# Altium project QUTMS-BMS-V01.PrjPcb
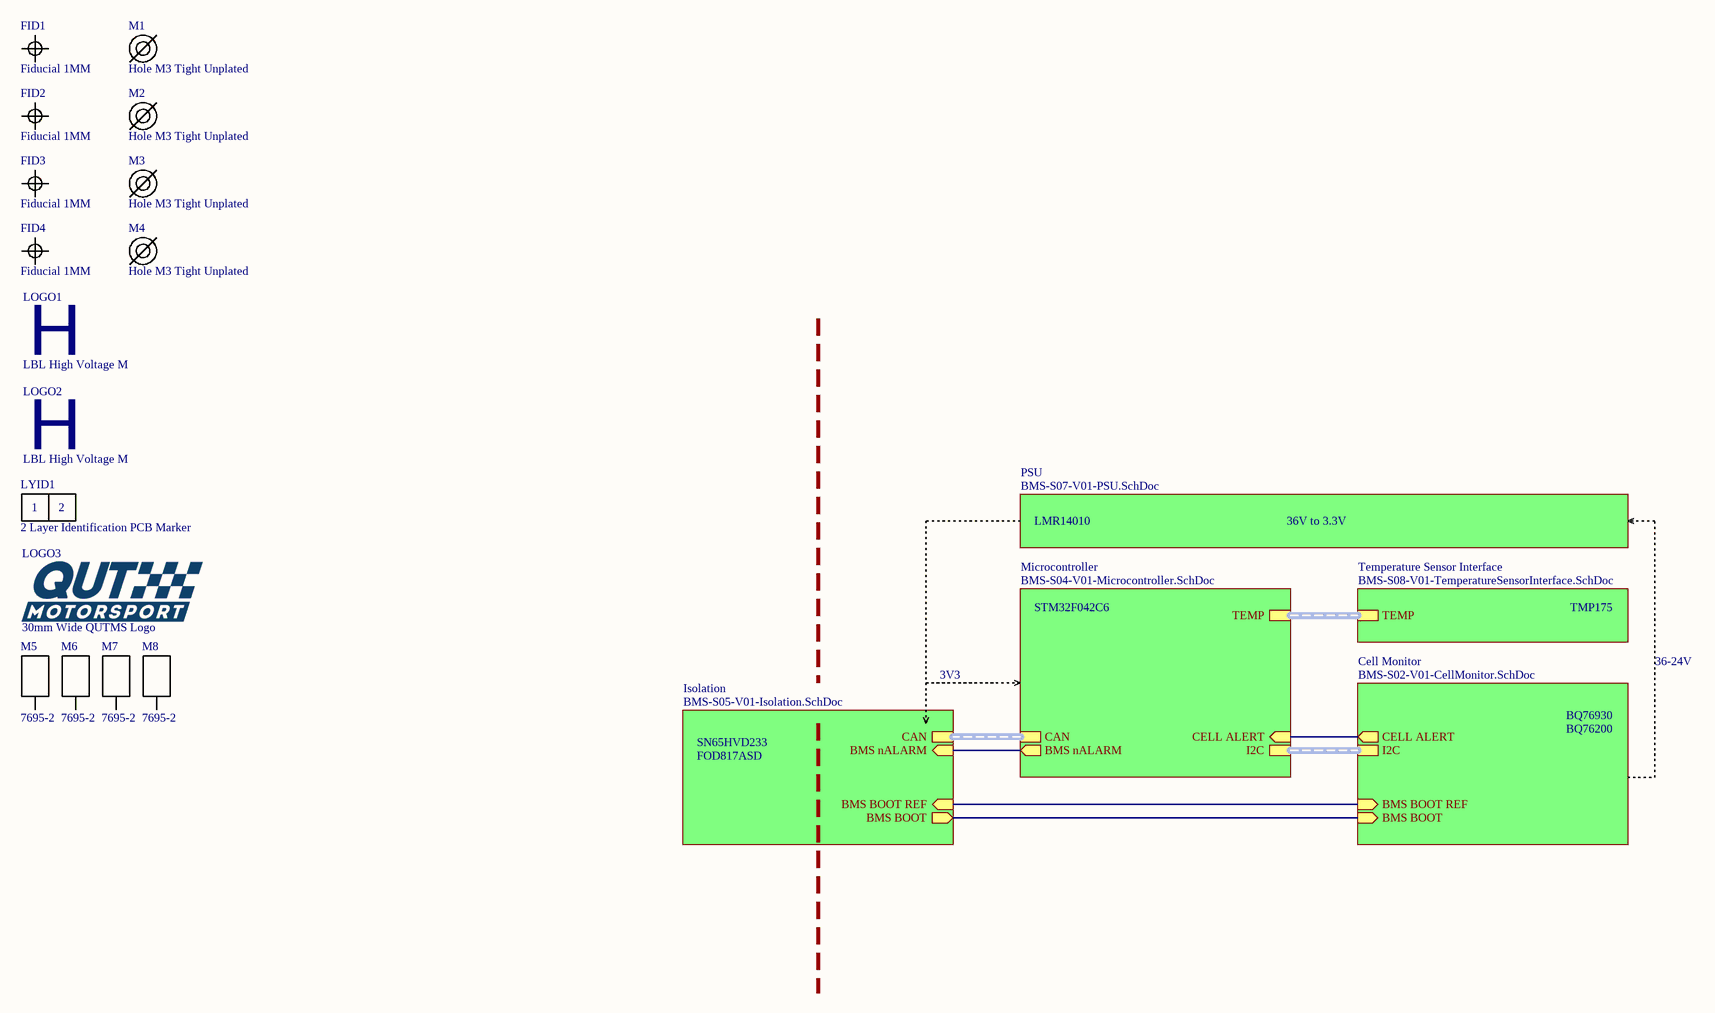
[diagram p0: BMS-S01-V01-BatteryManagementSystem.SchDoc]
9 sheets, 232 parts. Net scope: hierarchical (ports join the sheet entries above them; power ports are global).
Board file: BMS-P00-V01.PcbDoc
Sheets:
  BMS-S01-V01-BatteryManagementSystem.SchDoc
    Isolation = BMS-S05-V01-Isolation.SchDoc
      Isolated CAN = BMS-S06-V01-IsolatedCAN.SchDoc
    Microcontroller = BMS-S04-V01-Microcontroller.SchDoc
    Cell Monitor = BMS-S02-V01-CellMonitor.SchDoc
      CELL 10 INTERFACE = BMS-S03-V01-CellInterface.SchDoc
      CELL 1 INTERFACE = BMS-S03-V01-CellInterface.SchDoc
      CELL 2 INTERFACE = BMS-S03-V01-CellInterface.SchDoc
      CELL 3 INTERFACE = BMS-S03-V01-CellInterface.SchDoc
      CELL 4 INTERFACE = BMS-S03-V01-CellInterface.SchDoc
      CELL 5 INTERFACE = BMS-S03-V01-CellInterface.SchDoc
      CELL 6 INTERFACE = BMS-S03-V01-CellInterface.SchDoc
      CELL 7 INTERFACE = BMS-S03-V01-CellInterface.SchDoc
      CELL 8 INTERFACE = BMS-S03-V01-CellInterface.SchDoc
      CELL 9 INTERFACE = BMS-S03-V01-CellInterface.SchDoc
    PSU = BMS-S07-V01-PSU.SchDoc
    Temperature Sensor Interface = BMS-S08-V01-TemperatureSensorInterface.SchDoc
      FlexPCBTempSensors1 = BMS-S09-V01-TemperatureSensors.SchDoc
      FlexPCBTempSensors2 = BMS-S09-V01-TemperatureSensors.SchDoc
      FlexPCBTempSensors3 = BMS-S09-V01-TemperatureSensors.SchDoc
      FlexPCBTempSensors4 = BMS-S09-V01-TemperatureSensors.SchDoc

## Sheet BMS-S01-V01-BatteryManagementSystem.SchDoc: BMS Master
size A3; DrawnBy: Jonn Dillon; DocumentNumber: 1; Revision: 01; SheetNumber: 1; SheetTotal: 10; Version: 01; Project: Battery Managment System 2020; PageSetup: Record=PageOptions|CenterHorizontal=True|CenterVertical=True|PrintScale=0.97|XCorrection=1.00|YCorrection=1.00|PrintKind=0|BorderSize=5000000|LeftOffset=0|BottomOffset=0|Orientation=2|PaperLength=1000|PaperWidth=1000|Scale=100|PaperSource=7|PrintQuality=-4|MediaType=1|DitherType=10|PaperKind=A4|PrintScaleMode=1

### Parts
FID1  Fiducial 1MM  [FIDUCIAL 1MM]
FID2  Fiducial 1MM  [FIDUCIAL 1MM]
FID3  Fiducial 1MM  [FIDUCIAL 1MM]
FID4  Fiducial 1MM  [FIDUCIAL 1MM]
LOGO1  LBL High Voltage M  [LBL HV MEDIUM]
LOGO2  LBL High Voltage M  [LBL HV MEDIUM]
LOGO3  30mm Wide QUTMS Logo  [QUTMS LOGO 30MM]
LYID1  2 Layer Identification PCB Marker  [LAYER IDENT 2]
M1  Hole M3 Tight Unplated  [M3.2 UNPLATED]
M2  Hole M3 Tight Unplated  [M3.2 UNPLATED]
M3  Hole M3 Tight Unplated  [M3.2 UNPLATED]
M4  Hole M3 Tight Unplated  [M3.2 UNPLATED]
M5  7695-2  [Keystone 7790]
M6  7695-2  [Keystone 7790]
M7  7695-2  [Keystone 7790]
M8  7695-2  [Keystone 7790]

### Sub-sheets
Cell Monitor = BMS-S02-V01-CellMonitor.SchDoc: BMS BOOT REF (in), BMS BOOT (in), I2C (harness I2C), CELL ALERT (out)
Isolation = BMS-S05-V01-Isolation.SchDoc: BMS BOOT (out), BMS nALARM (in), BMS BOOT REF (in), CAN (harness CAN)
Microcontroller = BMS-S04-V01-Microcontroller.SchDoc: I2C (harness I2C), CAN (harness CAN), BMS nALARM (out), CELL ALERT (in), TEMP (harness TEMP)
PSU = BMS-S07-V01-PSU.SchDoc: no entries
Temperature Sensor Interface = BMS-S08-V01-TemperatureSensorInterface.SchDoc: TEMP (harness TEMP)

### Nets
BMS BOOT: sheet Isolation/BMS BOOT, sheet Cell Monitor/BMS BOOT
BMS BOOT REF: sheet Isolation/BMS BOOT REF, sheet Cell Monitor/BMS BOOT REF
CELL ALERT: sheet Microcontroller/CELL ALERT, sheet Cell Monitor/CELL ALERT
nALARM: sheet Isolation/BMS nALARM, sheet Microcontroller/BMS nALARM

Not connected (* = marked no-connect by the designer): M5 0; M6 0; M7 0; M8 0

### Buses and harness runs
harness sheet Cell Monitor/I2C = sheet Microcontroller/I2C
harness sheet Isolation/CAN = sheet Microcontroller/CAN
harness sheet Microcontroller/TEMP = sheet Temperature Sensor Interface/TEMP

### Notes on the sheet
- LMR14010
- 36V to 3.3V
- STM32F042C6
- TMP175
- 3V3
- 36-24V
- SN65HVD233
- BQ76930
- BQ76200
- FOD817ASD
- Revision History:
- Sheet Title:
- Rev
- Date
- Description
- Project:
- Size:
- Drawn By:
- A3
- Number:
- Revision:
- Sheet
- Version:
- of
- QUT Motorsport
- O-120, Gardens Point
- 2 George Street
- Brisbane, QLD 4000
- Australia
- Print Date:
- Print Time:
- File Name:
- (in symbol Layer Identification 2) 1; 2
- (in symbol LBL High Voltage M) H

### Library data of the parts
LOGO3 = QUTMS Logo 30mm
LYID1 = Layer Identification 2
M1-M4 = Hole M3 Tight Unplated: M3.2 Hole, No Plating
M5-M8 = 7695-2: SNAP-INPC MOUNT

## Sheet BMS-S05-V01-Isolation.SchDoc: Isolation Barrier
size A3; DrawnBy: Jonn Dillon; DocumentNumber: 3; Revision: 01; SheetNumber: 3; SheetTotal: 10; Version: 01; Project: Battery Management System 2020; PageSetup: Record=PageOptions|CenterHorizontal=True|CenterVertical=True|PrintScale=0.97|XCorrection=1.00|YCorrection=1.00|PrintKind=0|BorderSize=5000000|LeftOffset=0|BottomOffset=0|Orientation=2|PaperLength=1000|PaperWidth=1000|Scale=100|PaperSource=7|PrintQuality=-4|MediaType=1|DitherType=10|PaperKind=A4|PrintScaleMode=1
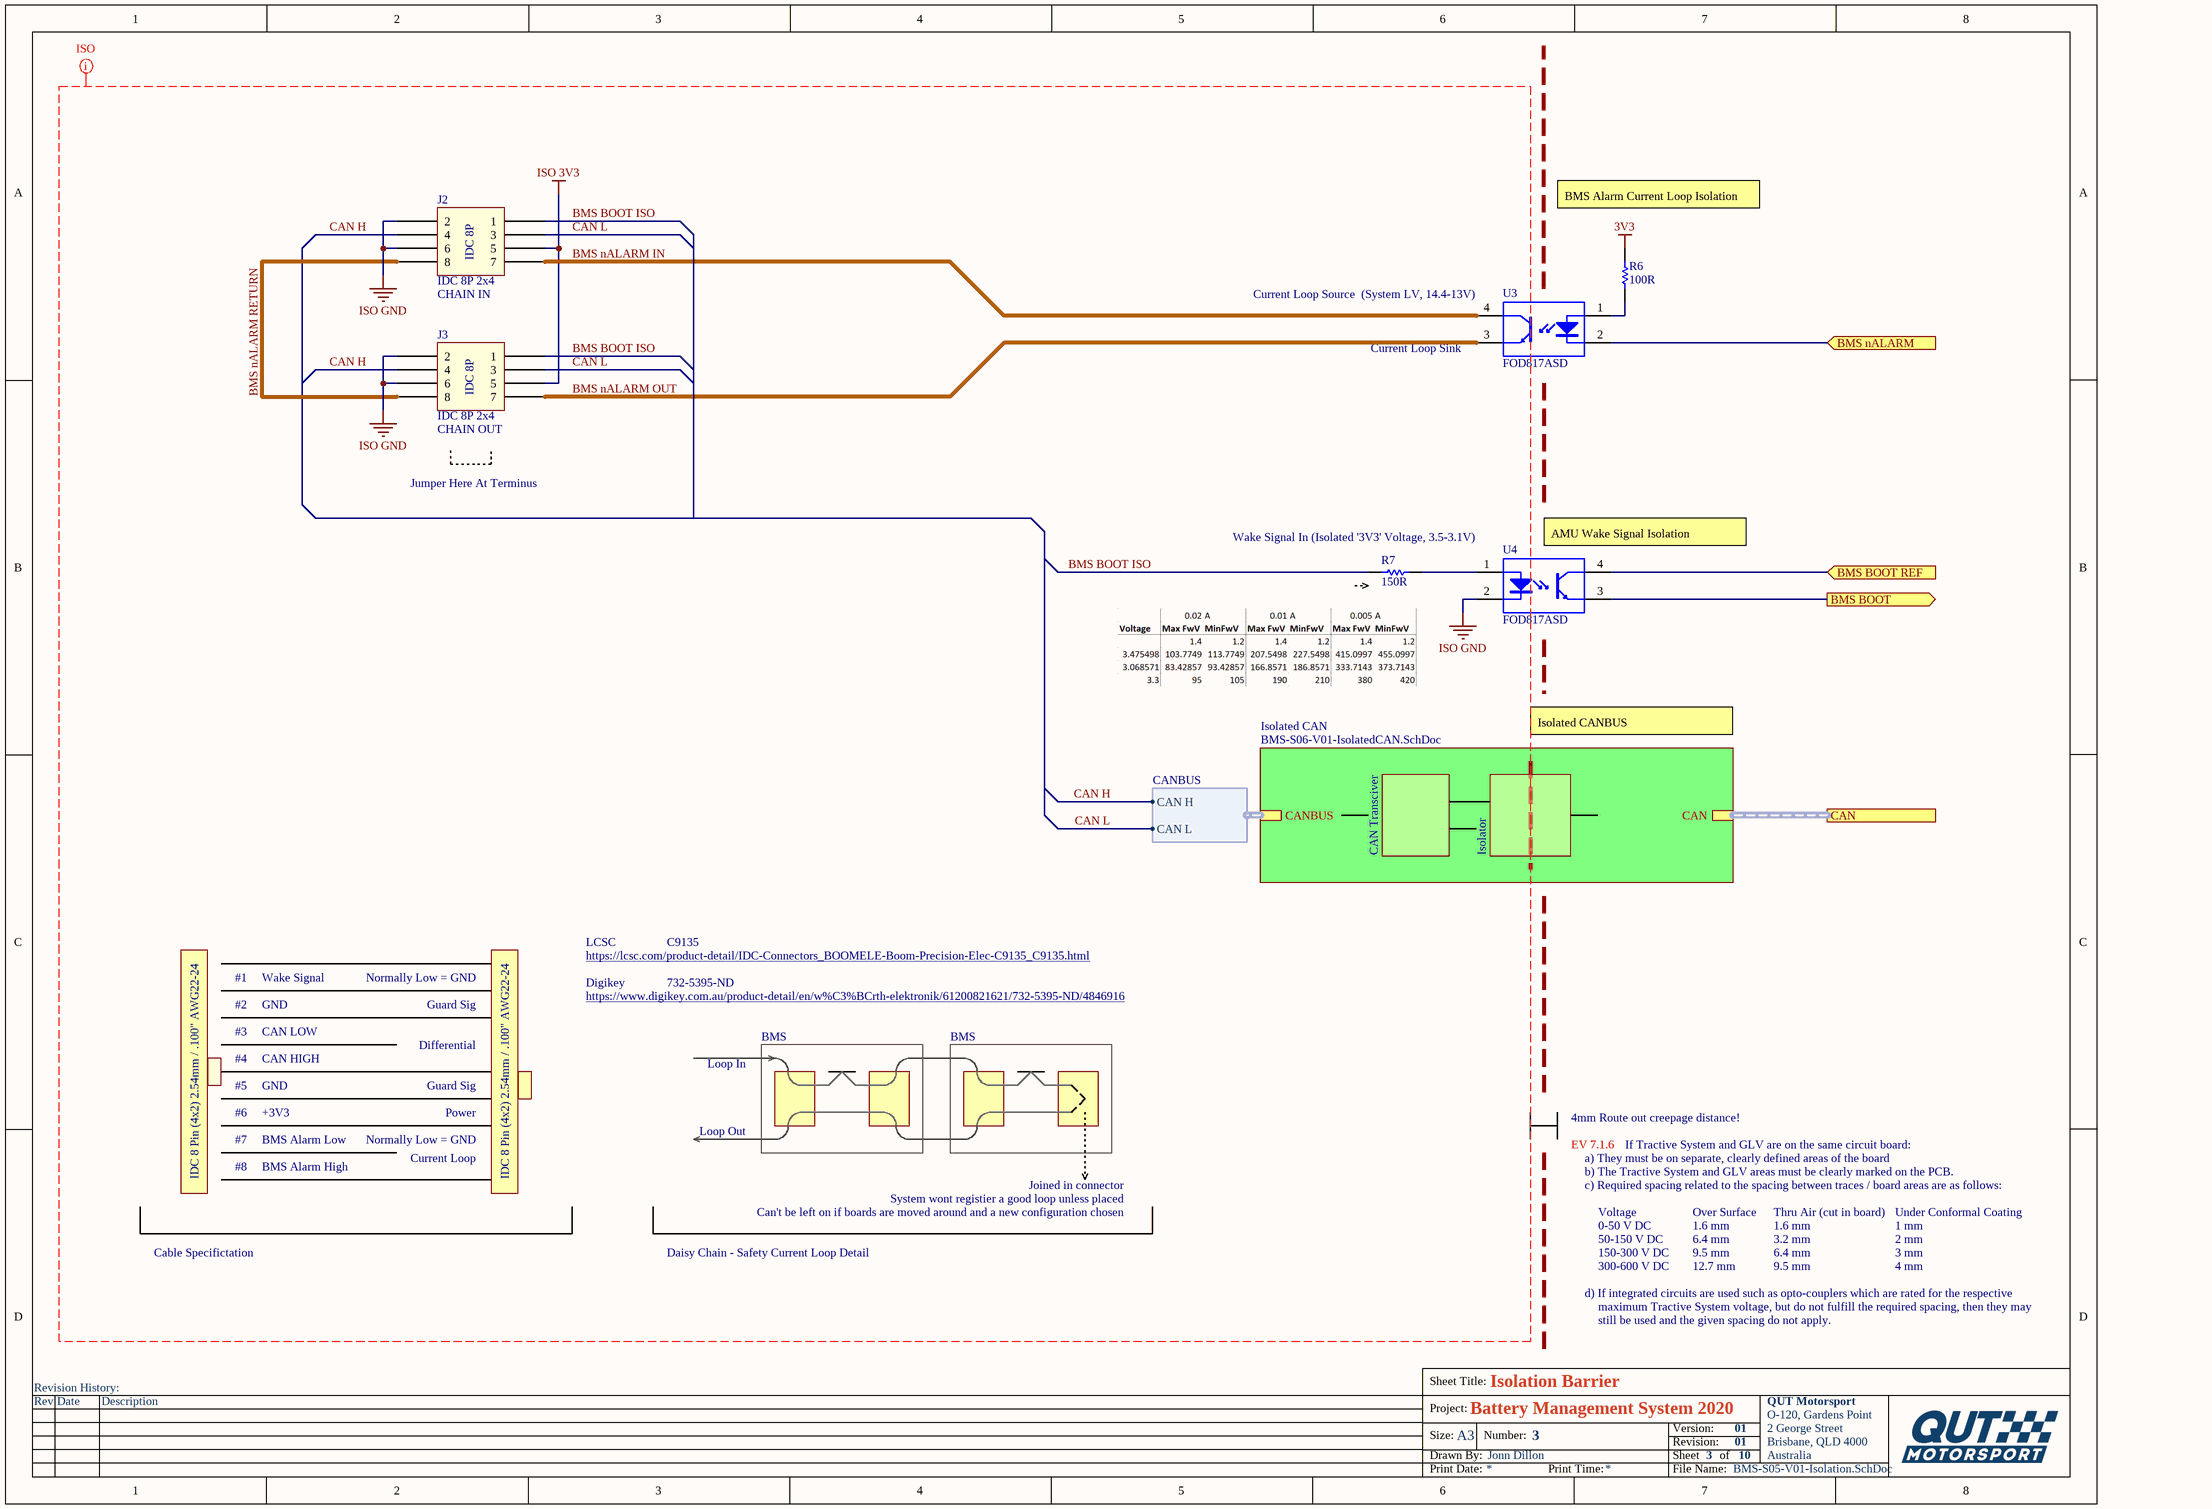
[diagram p1: BMS-S05-V01-Isolation.SchDoc]

### Parts
J2  IDC 8P 2x4  [IDC 2.54MM 8P]
J3  IDC 8P 2x4  [IDC 2.54MM 8P]
R6  100R  [Res_ThinFilm_0603]
R7  150R  [Res_ThinFilm_0603]
U3  FOD817ASD  [FOD817ASD]
U4  FOD817ASD  [FOD817ASD]

### Sub-sheets
Isolated CAN = BMS-S06-V01-IsolatedCAN.SchDoc: CANBUS (harness CANBUS), CAN (harness CAN)

### Ports
BMS BOOT (out), BMS BOOT REF (in), BMS nALARM (in), CAN (harness CAN)

### Harnesses
CANBUS: CAN H, CAN L

### Nets
3V3: R6.2
ISO 3V3: J2.5 J3.5
ISO GND: J2.2 J2.6 J3.2 J3.6 U4.2(CATHODE)
BMS BOOT: U4.3(EMITTER) ; port BMS BOOT
BMS BOOT ISO: J2.1 J3.1 R7.1
BMS BOOT REF: U4.4(COLLECTOR) ; port BMS BOOT REF
BMS nALARM IN: J2.7 U3.4(COLLECTOR)
BMS nALARM OUT: J3.7 U3.3(EMITTER)
BMS nALARM RETURN: J2.8 J3.8
CAN H: J2.4 J3.4 ; sheet Isolated CAN/CANBUS.CAN H
CAN L: J2.3 J3.3 ; sheet Isolated CAN/CANBUS.CAN L
nALARM: U3.2(CATHODE) ; port BMS nALARM
NetR6_1: R6.1 U3.1(ANODE)
NetR7_2: R7.2 U4.1(ANODE)

### Buses and harness runs
harness port CAN = sheet Isolated CAN/CAN

### Layout directives
mark named ISO: BMS BOOT ISO, BMS nALARM IN, BMS nALARM OUT, BMS nALARM RETURN, CAN H, CAN L, ISO 3V3, ISO GND

### Notes on the sheet
- BMS Alarm Current Loop Isolation
- (near J2) CHAIN IN
- (near U3) Current Loop Source  (System LV, 14.4-13V)
- (near U3) Current Loop Sink
- (near J3) CHAIN OUT
- Jumper Here At Terminus
- Wake Signal In (Isolated '3V3' Voltage, 3.5-3.1V)
- (near U4) AMU Wake Signal Isolation
- Isolated CANBUS
- CAN Transciver
- Isolator
- #1
- Wake Signal
- Normally Low = GND
- LCSC
- https://lcsc.com/product-detail/IDC-Connectors_BOOMELE-Boom-Precision-Elec-C9135_C9135.html
- Digikey
- 732-5395-ND
- C9135
- #2
- #3
- #4
- CAN LOW
- CAN HIGH
- GND
- Differential
- Guard Sig
- https://www.digikey.com.au/product-detail/en/w%C3%BCrth-elektronik/61200821621/732-5395-ND/4846916
- BMS
- #5
- #6
- +3V3
- Power
- Loop In
- 4mm Route out creepage distance!
- IDC 8 Pin (4x2) 2.54mm / .100" AWG22-24
- #7
- #8
- BMS Alarm High
- BMS Alarm Low
- Current Loop
- Loop Out
- Joined in connector
- EV 7.1.6
- a) They must be on separate, clearly defined areas of the board
- b) The Tractive System and GLV areas must be clearly marked on the PCB.
- c) Required spacing related to the spacing between traces / board areas are as follows:
- If Tractive System and GLV are on the same circuit board:
- Cable Specifictation
- Daisy Chain - Safety Current Loop Detail
- System wont registier a good loop unless placed
- Can't be left on if boards are moved around and a new configuration chosen
- Voltage
- 0-50 V DC
- 50-150 V DC
- 150-300 V DC
- Over Surface
- 1.6 mm
- 6.4 mm
- 9.5 mm
- Thru Air (cut in board)
- 3.2 mm
- Under Conformal Coating
- 1 mm
- 2 mm
- 3 mm
- d) If integrated circuits are used such as opto-couplers which are rated for the respective
- 300-600 V DC
- maximum Tractive System voltage, but do not fulfill the required spacing, then they may
- still be used and the given spacing do not apply.
- 12.7 mm
- 4 mm
- Revision History:
- Sheet Title:
- Rev
- Date
- Description
- Project:
- Size:
- Drawn By:
- A3
- Number:
- Revision:
- Sheet
- Version:
- of
- QUT Motorsport
- O-120, Gardens Point
- 2 George Street
- Brisbane, QLD 4000
- Australia
- Print Date:
- Print Time:
- File Name:
- (in symbol IDC 8P 2x4) IDC 8P

### Library data of the parts
J2 J3 = IDC 8P 2x4: IDC 8P 2x5
R6 = 100R 5%, 0603: Resistor, SMD, 100R, 0.1W, 5%, 0603
R7 = 150R 5% 0603: Resistor, SMD, 150R, 0.1W, 5%, 0603
U3 U4 = FOD817ASD: Optoisolator 5kV Transistor 4SMD

## Sheet BMS-S06-V01-IsolatedCAN.SchDoc: Isolated CANBUS @ 3V3
size A3; DrawnBy: Jonn Dillon; DocumentNumber: 4; Revision: 01; SheetNumber: 4; SheetTotal: 10; Version: 01; Project: Battery Managment System 2020; PageSetup: Record=PageOptions|CenterHorizontal=True|CenterVertical=True|PrintScale=0.97|XCorrection=1.00|YCorrection=1.00|PrintKind=0|BorderSize=5000000|LeftOffset=0|BottomOffset=0|Orientation=2|PaperLength=1000|PaperWidth=1000|Scale=100|PaperSource=7|PrintQuality=-4|MediaType=1|DitherType=10|PaperKind=A4|PrintScaleMode=1
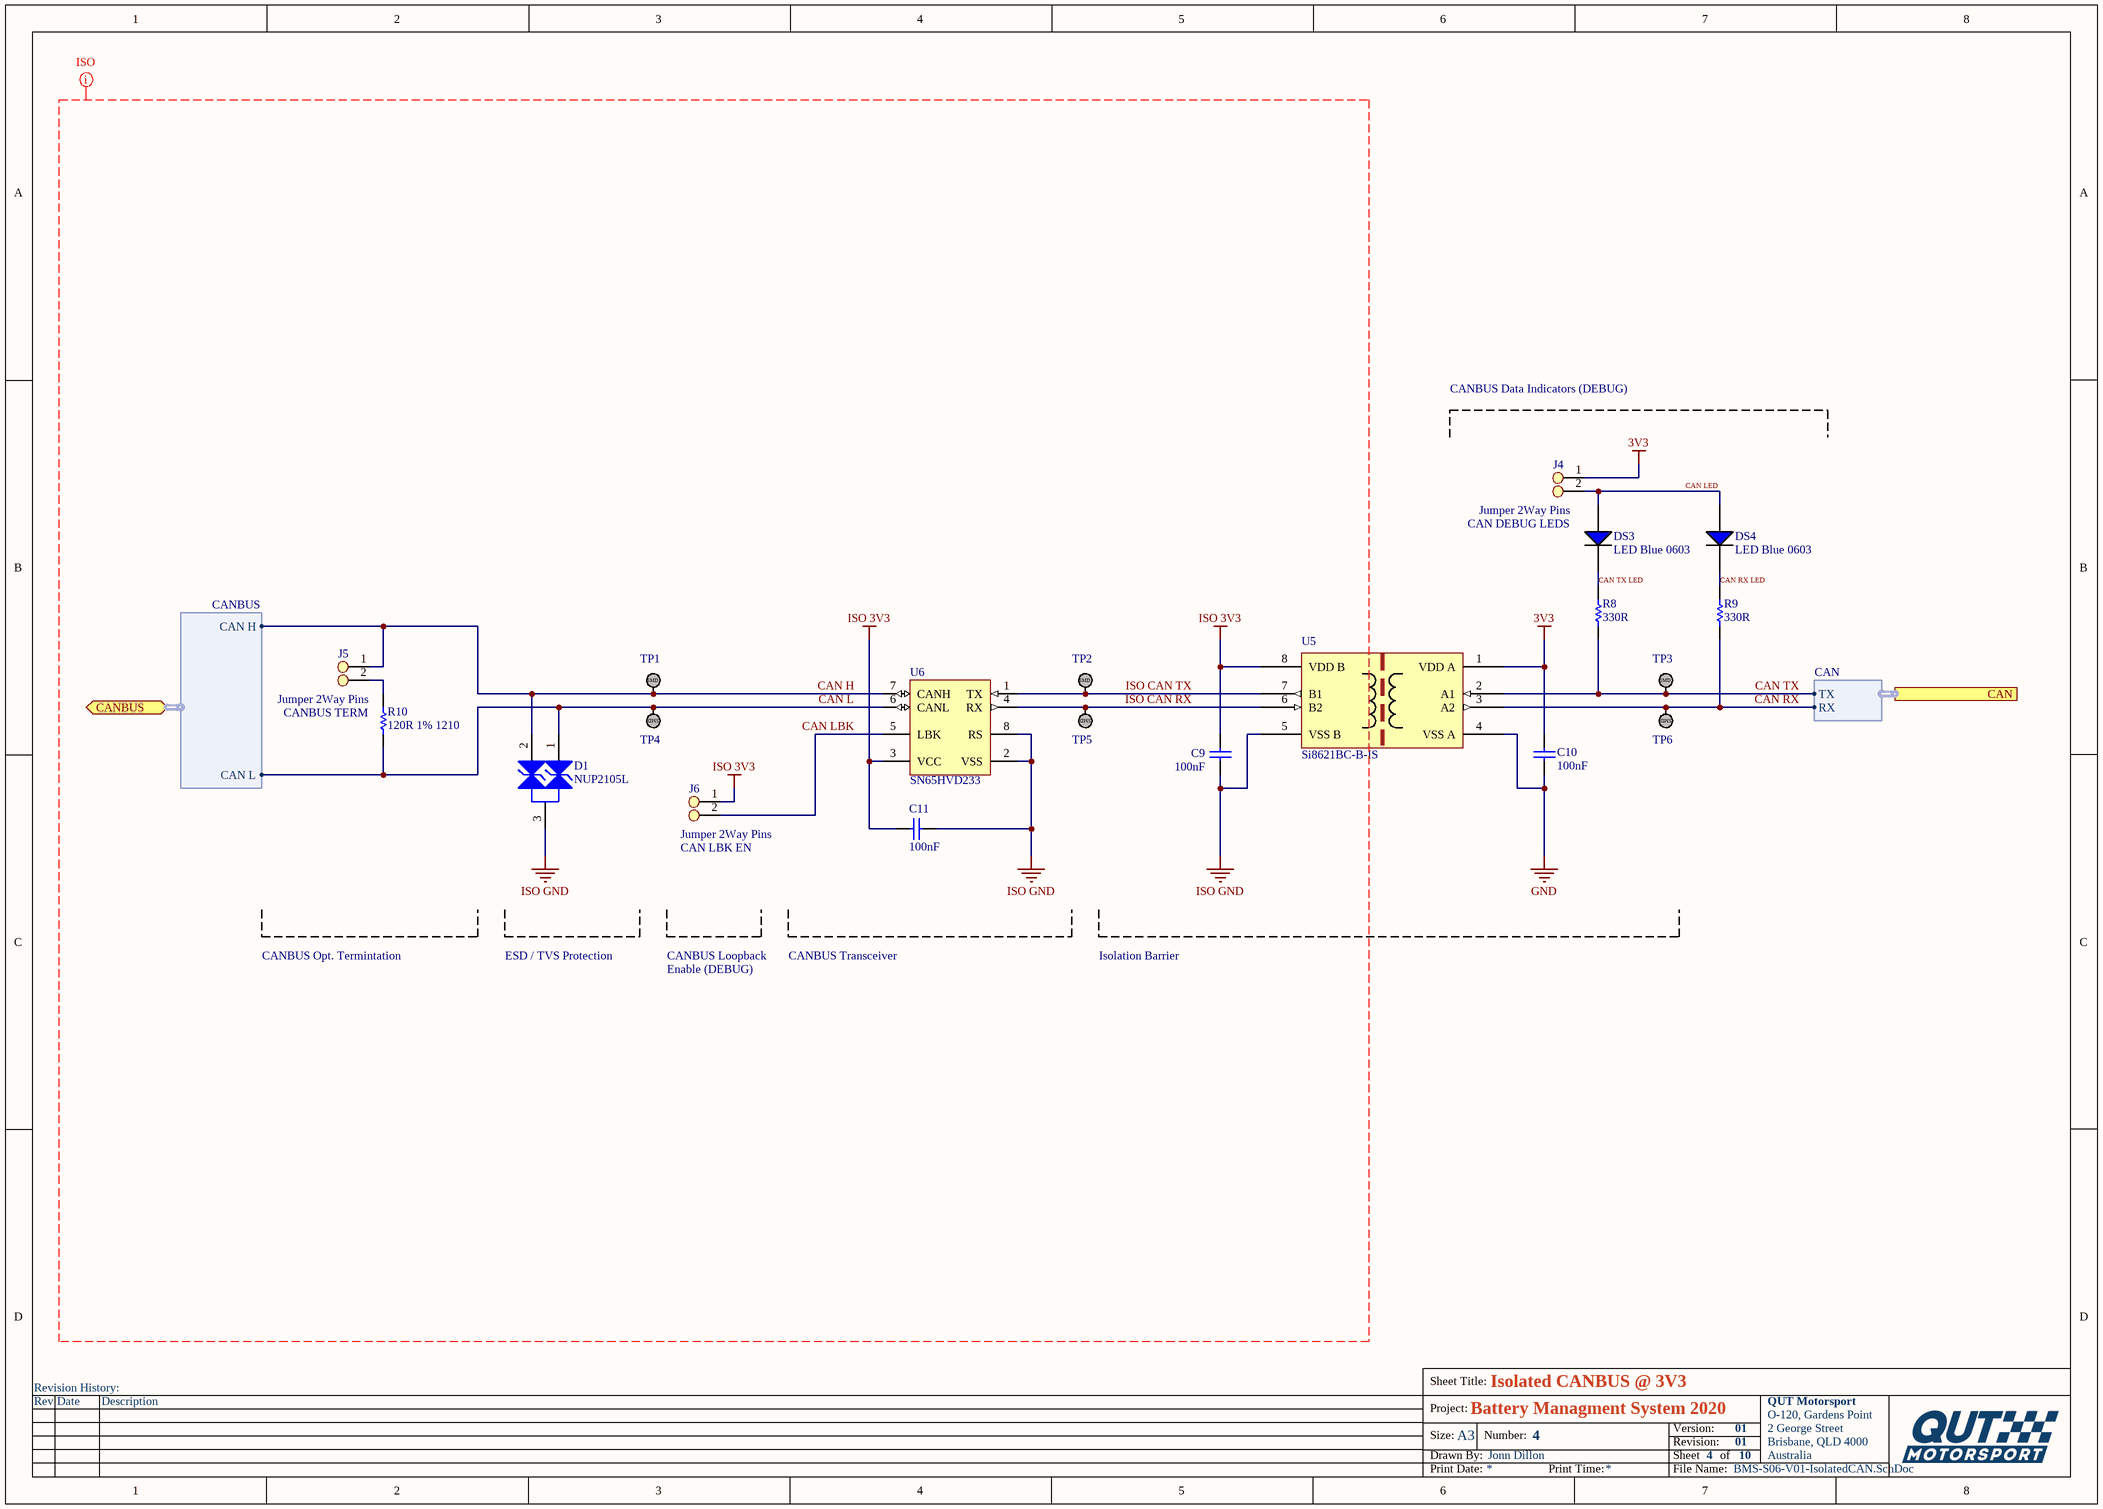
[diagram p2: BMS-S06-V01-IsolatedCAN.SchDoc]

### Parts
C9  100nF  [Cap_Ceramic_0603]
C10  100nF  [Cap_Ceramic_0603]
C11  100nF  [Cap_Ceramic_0603]
D1  NUP2105L  [NUP2105L]
DS3  LED Blue 0603  [LED BLUE 0603]
DS4  LED Blue 0603  [LED BLUE 0603]
J4  Jumper 2Way Pins  [Jumper_2Way_Pin]
J5  Jumper 2Way Pins  [Jumper_2Way_Pin]
J6  Jumper 2Way Pins  [Jumper_2Way_Pin]
R8  330R  [Res_ThinFilm_0603]
R9  330R  [Res_ThinFilm_0603]
R10  120R 1% 1210  [Res_ThinFilm_1210]
TP1  TestPoint_SMD  [TestPointSMD]  (value not drawn)
TP2  TestPoint_SMD  [TestPointSMD]  (value not drawn)
TP3  TestPoint_SMD  [TestPointSMD]  (value not drawn)
TP4  TestPoint_SMD  [TestPointSMD]  (value not drawn)
TP5  TestPoint_SMD  [TestPointSMD]  (value not drawn)
TP6  TestPoint_SMD  [TestPointSMD]  (value not drawn)
U5  Si8621BC-B-IS  [Si8621BC-B-IS]
U6  SN65HVD233  [SN65HVD233DR]

### Ports
CAN (harness CAN), CANBUS (bidir, harness CANBUS)

### Harnesses
CANBUS: CAN H, CAN L
CAN: RX, TX

### Nets
3V3: C10.2 J4.1 U5.1(VDD_A)
GND: C10.1 U5.4(VSS_A)
ISO 3V3: C9.2 C11.2 J6.1 U5.8(VDD_B) U6.3(VCC)
ISO GND: C9.1 C11.1 D1.3 U5.5(VSS_B) U6.2(VSS) U6.8(RS)
CAN H: D1.2 J5.1 TP1.1 U6.7(CANH) ; port CANBUS.CAN H
CAN L: D1.1 R10.1 TP4.1 U6.6(CANL) ; port CANBUS.CAN L
CAN LBK: J6.2 U6.5(LBK)
CAN LED: DS3.1(A) DS4.1(A) J4.2
CAN RX: R9.1 TP6.1 U5.3(A2) ; port CAN.RX
CAN RX LED: DS4.2(C) R9.2
CAN TX: R8.1 TP3.1 U5.2(A1) ; port CAN.TX
CAN TX LED: DS3.2(C) R8.2
ISO CAN RX: TP5.1 U5.6(B2) U6.4(RX)
ISO CAN TX: TP2.1 U5.7(B1) U6.1(TX)
NetJ5_2: J5.2 R10.2

### Layout directives
mark named ISO: CAN H, CAN L, CAN LBK, ISO 3V3, ISO CAN RX, ISO CAN TX, ISO GND

### Notes on the sheet
- CANBUS Data Indicators (DEBUG)
- CAN DEBUG LEDS
- (near R10) CANBUS TERM
- (near J6) CAN LBK EN
- CANBUS Opt. Termintation
- ESD / TVS Protection
- CANBUS Loopback
- Enable (DEBUG)
- CANBUS Transceiver
- Isolation Barrier
- Revision History:
- Sheet Title:
- Rev
- Date
- Description
- Project:
- Size:
- Drawn By:
- A3
- Number:
- Revision:
- Sheet
- Version:
- of
- QUT Motorsport
- O-120, Gardens Point
- 2 George Street
- Brisbane, QLD 4000
- Australia
- Print Date:
- Print Time:
- File Name:
- (in symbol TestPoint_SMD) SMD

### Library data of the parts
C9-C11 = 100nF 50V 5% X7R 0603: Capacitor, Ceramic, SMD, 100nF, 50V, 5%, X7R, 0603
J4-J6 = Jumper 2Way Side Pins
R8 R9 = 330R 5% 0603: Resistor, SMD, 330R, 0.1W, 5%, 0603
R10 = 120R 1% 1210: Resistor, SMD, 120R, 0.25W, 1%, 1210
D1 = NUP2105L: ComponentLink1Description: Datasheet; ComponentLink1URL: https://www.onsemi.cn/PowerSolutions/document/NUP2105L-D.PDF; Parameter 1: *; ComponentLink2Description: LCSC; ComponentLink2URL: https://lcsc.com/product-detail/TVS_ON-Semiconductor-NUP2105LT1G_C14486.html; ComponentLink3Description: Digikey; ComponentLink3URL: https://www.digikey.com.au/product-detail/en/on-semiconductor/SZNUP2105LT1G/SZNUP2105LT1GOSCT-ND/3487669
U5 = Si8621BC-B-IS: ComponentLink1Description: Digikey; ComponentLink1URL: https://www.digikey.com.au/product-detail/en/silicon-labs/SI8621BC-B-ISR/336-4774-1-ND/8611005; ComponentLink2Description: Datasheet; ComponentLink2URL: https://www.silabs.com/documents/public/data-sheets/si861x-2x-datasheet.pdf
U6 = SN65HVD233: ComponentLink1Description: LCSC; ComponentLink1URL: https://lcsc.com/product-detail/CAN-ICs_Texas-Instruments_SN65HVD233DRG4_Texas-Instruments-Texas-Instruments-SN65HVD233DRG4_C61643.html; ComponentLink2Description: Digikey; ComponentLink2URL: https://www.digikey.com.au/product-detail/en/texas-instruments/SN65HVD233DR/296-35967-1-ND/4134960; ComponentLink3Description: Datasheet; ComponentLink3URL: https://www.ti.com/lit/ds/symlink/sn65hvd233.pdf?ts=1588560888178; ComponentLink4Description: Ti Product Page; ComponentLink4URL: https://www.ti.com/product/SN65HVD233

## Sheet BMS-S04-V01-Microcontroller.SchDoc: Microcontroller
size A3; DrawnBy: Zoe Goodward; DocumentNumber: 2; Revision: 01; SheetNumber: 2; SheetTotal: 10; Version: 01; Project: Battery Managment System 2020; PageSetup: Record=PageOptions|CenterHorizontal=True|CenterVertical=True|PrintScale=0.97|XCorrection=1.00|YCorrection=1.00|PrintKind=0|BorderSize=5000000|LeftOffset=0|BottomOffset=0|Orientation=2|PaperLength=1000|PaperWidth=1000|Scale=100|PaperSource=7|PrintQuality=-4|MediaType=1|DitherType=10|PaperKind=A4|PrintScaleMode=1
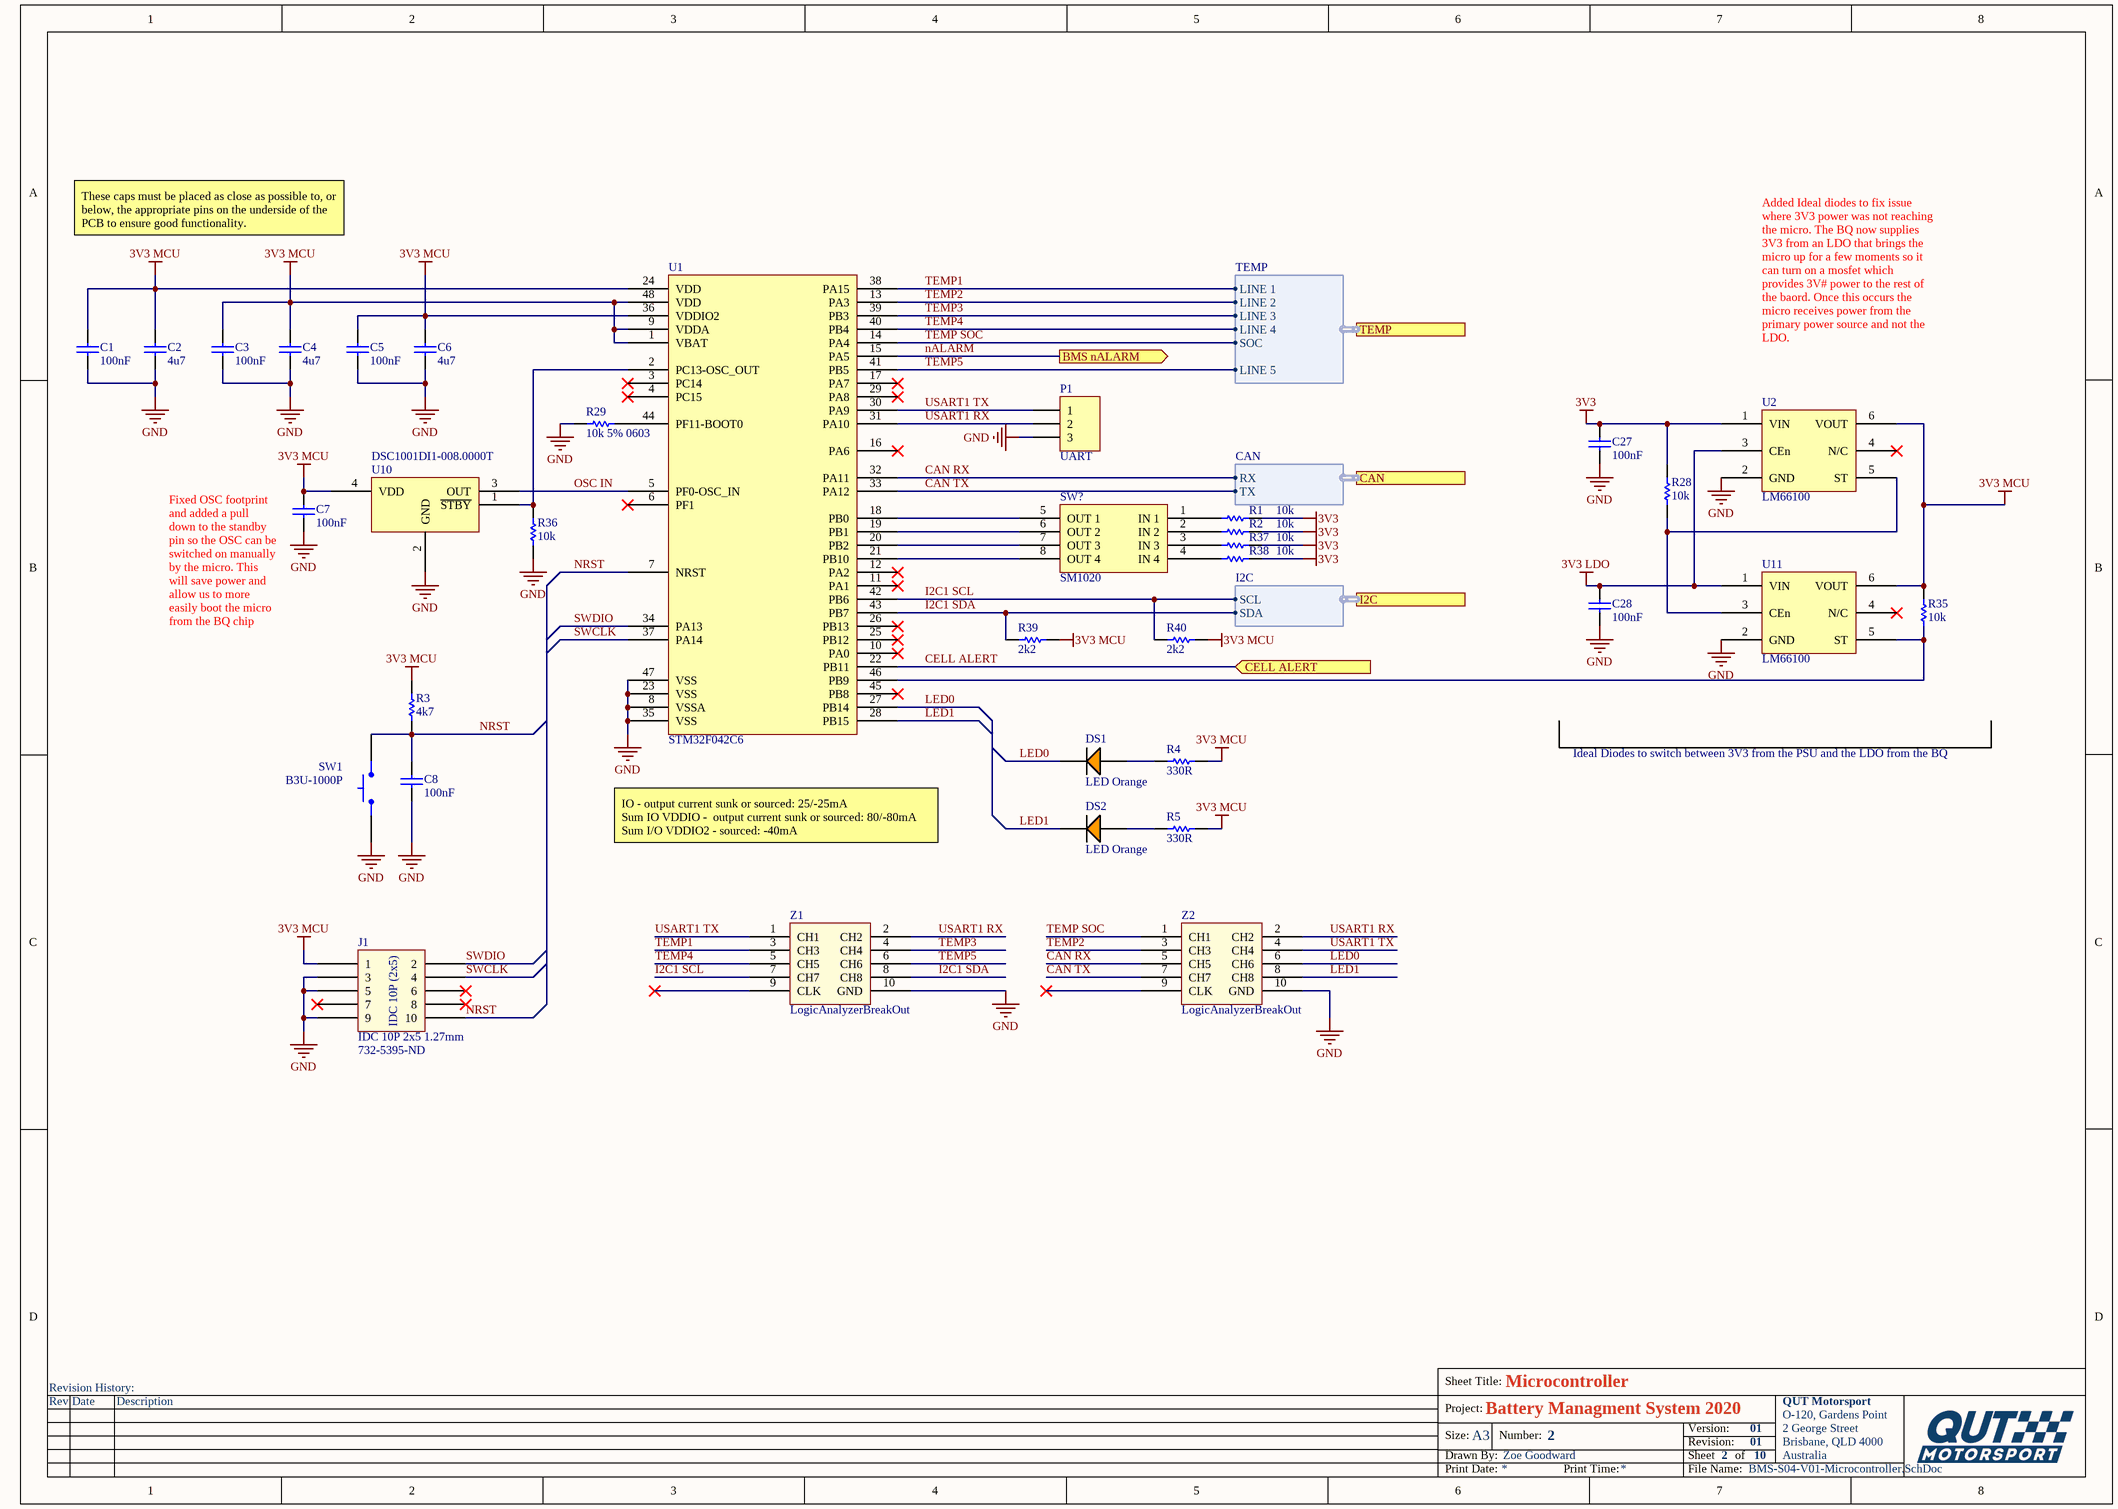
[diagram p3: BMS-S04-V01-Microcontroller.SchDoc]

### Parts
C1  100nF  [Cap_Ceramic_0603]
C2  4u7  [Cap_Ceramic_0603]
C3  100nF  [Cap_Ceramic_0603]
C4  4u7  [Cap_Ceramic_0603]
C5  100nF  [Cap_Ceramic_0603]
C6  4u7  [Cap_Ceramic_0603]
C7  100nF  [Cap_Ceramic_0603]
C8  100nF  [Cap_Ceramic_0603]
C27  100nF  [Cap_Ceramic_0603]
C28  100nF  [Cap_Ceramic_0603]
DS1  LED Orange  [LED ORANGE 0603]
DS2  LED Orange  [LED ORANGE 0603]
J1  IDC 10P 2x5 1.27mm  [IDC 1.27MM 10P]
P1  UART  [HDR1X3]
R1  10k  [Res_ThinFilm_0603]
R2  10k  [Res_ThinFilm_0603]
R3  4k7  [Res_ThinFilm_0603]
R4  330R  [Res_ThinFilm_0603]
R5  330R  [Res_ThinFilm_0603]
R28  10k  [Res_ThinFilm_0603]
R29  10k 5% 0603  [Res_ThinFilm_0603]
R35  10k  [Res_ThinFilm_0603]
R36  10k  [Res_ThinFilm_0603]
R37  10k  [Res_ThinFilm_0603]
R38  10k  [Res_ThinFilm_0603]
R39  2k2  [Res_ThinFilm_0603]
R40  2k2  [Res_ThinFilm_0603]
SW1  B3U-1000P  [BTN B3U-1000P]
SW?  SM1020  [SM1020]
U1  STM32F042C6  [STM32F042C6]
U2  LM66100  [LM66100]
U10  DSC1001DI1-008.0000T  [DSC1001DI1-008.0000TCT-ND]
U11  LM66100  [LM66100]
Z1  LogicAnalyzerBreakOut  [LogicAnalyzer]
Z2  LogicAnalyzerBreakOut  [LogicAnalyzer]

### Ports
BMS nALARM (out), CAN (harness CAN), CELL ALERT (in), I2C (harness I2C), TEMP (harness TEMP)

### Harnesses
CAN: RX, TX
TEMP: LINE 1, LINE 2, LINE 3, LINE 4, LINE 5, SOC
I2C: SCL, SDA

### Nets
3V3: C27.2 R1.2 R2.2 R28.2 R37.2 R38.2 U2.1(VIN)
3V3 LDO: C28.2 U2.3(CEn) U11.1(VIN)
3V3 MCU: C1.2 C2.2 C3.2 C4.2 C5.2 C6.2 C7.2 J1.1 R3.2 R4.2 R5.2 R35.2 R39.2 R40.2 U1.1(VBAT) U1.9(VDDA) U1.24(VDD) U1.36(VDDIO2) U1.48(VDD) U2.6(VOUT) U10.4(VDD) U11.6(VOUT)
GND: C1.1 C2.1 C3.1 C4.1 C5.1 C6.1 C7.1 C8.1 C27.1 C28.1 J1.3 J1.5 J1.9 P1.3 R29.1 R36.1 SW1.1 U1.8(VSSA) U1.23(VSS) U1.35(VSS) U1.47(VSS) U2.2(GND) U10.2(GND) U11.2(GND) Z1.10(GND) Z2.10(GND)
CAN RX: U1.32(PA11) Z2.5(CH5) ; port CAN.RX
CAN TX: U1.33(PA12) Z2.7(CH7) ; port CAN.TX
CELL ALERT: U1.22(PB11) ; port CELL ALERT
I2C1 SCL: R40.1 U1.42(PB6) Z1.7(CH7) ; port I2C.SCL  [project net I2C SCL]
I2C1 SDA: R39.1 U1.43(PB7) Z1.8(CH8) ; port I2C.SDA  [project net I2C SDA]
LED0: DS1.2(C) U1.27(PB14) Z2.6(CH6)
LED1: DS2.2(C) U1.28(PB15) Z2.8(CH8)
nALARM: U1.15(PA5) ; port BMS nALARM
NRST: C8.2 J1.10 R3.1 SW1.2 U1.7(NRST)
OSC IN: U1.5(PF0-OSC_IN) U10.3(OUT)
SWCLK: J1.4 U1.37(PA14)
SWDIO: J1.2 U1.34(PA13)
TEMP1: U1.38(PA15) Z1.3(CH3) ; port TEMP.LINE 1
TEMP2: U1.13(PA3) Z2.3(CH3) ; port TEMP.LINE 2
TEMP3: U1.39(PB3) Z1.4(CH4) ; port TEMP.LINE 3
TEMP4: U1.40(PB4) Z1.5(CH5) ; port TEMP.LINE 4
TEMP5: U1.41(PB5) Z1.6(CH6) ; port TEMP.LINE 5
TEMP SOC: U1.14(PA4) Z2.1(CH1) ; port TEMP.SOC
USART1 RX: P1.2 U1.31(PA10) Z1.2(CH2) Z2.2(CH2)
USART1 TX: P1.1 U1.30(PA9) Z1.1(CH1) Z2.4(CH4)
NetDS1_1: DS1.1(A) R4.1
NetDS2_1: DS2.1(A) R5.1
NetR1_1: R1.1 SW?.1(IN_1)
NetR2_1: R2.1 SW?.2(IN_2)
NetR28_1: R28.1 U2.5(ST) U11.3(CEn)
NetR29_2: R29.2 U1.44(PF11-BOOT0)
NetR35_1: R35.1 U1.46(PB9) U11.5(ST)
NetR36_2: R36.2 U1.2(PC13-OSC_OUT) U10.1(~{STBY})
NetR37_1: R37.1 SW?.3(IN_3)
NetR38_1: R38.1 SW?.4(IN_4)
NetSW?_5: SW?.5(OUT_1) U1.18(PB0)
NetSW?_6: SW?.6(OUT_2) U1.19(PB1)
NetSW?_7: SW?.7(OUT_3) U1.20(PB2)
NetSW?_8: SW?.8(OUT_4) U1.21(PB10)

Not connected (* = marked no-connect by the designer): J1 6* 7* 8*; U1 3(PC14)* 4(PC15)* 6(PF1)* 10(PA0)* 11(PA1)* 12(PA2)* 16(PA6)* 17(PA7)* 25(PB12)* 26(PB13)* 29(PA8)* 45(PB8)*; U2 4(N/C)*; U11 4(N/C)*; Z1 9(CLK)*; Z2 9(CLK)*

### Notes on the sheet
- These caps must be placed as close as possible to, or below, the appropriate pins on the underside of the PCB to ensure good functionality.
- Added Ideal diodes to fix issue where 3V3 power was not reaching the micro. The BQ now supplies 3V3 from an LDO that brings the micro up for a few moments so it can turn on a mosfet which provides 3V# power to the rest of the baord. Once this occurs the micro receives power from the primary power source and not the LDO.
- (near C7) Fixed OSC footprint and added a pull down to the standby pin so the OSC can be switched on manually by the micro. This will save power and allow us to more easily boot the micro from the BQ chip
- Ideal Diodes to switch between 3V3 from the PSU and the LDO from the BQ
- IO - output current sunk or sourced: 25/-25mA
  Sum IO VDDIO -  output current sunk or sourced: 80/-80mA
  Sum I/O VDDIO2 - sourced: -40mA
- (near J1) 732-5395-ND
- Revision History:
- Sheet Title:
- Rev
- Date
- Description
- Project:
- Size:
- Drawn By:
- A3
- Number:
- Revision:
- Sheet
- Version:
- of
- QUT Motorsport
- O-120, Gardens Point
- 2 George Street
- Brisbane, QLD 4000
- Australia
- Print Date:
- Print Time:
- File Name:
- (in symbol IDC 10P 2x5 1.27mm) IDC 10P (2x5)

### Library data of the parts
C1 C3 C5 C7 C8 C27 C28 = 100nF 50V 5% X7R 0603: as C9 on sheet BMS-S06-V01-IsolatedCAN
C2 C4 C6 = 4u7 50V 5% X7R 0603: Capacitor, Ceramic, SMD, 4u7, 50V, 5%, X7R, 0603
DS1 DS2 = LED ORANGE 0603
P1 = Header 3: Header, 3-Pin; LatestRevisionDate: 17-Jul-2002; LatestRevisionNote: Re-released for DXP Platform.; Publisher: Altium Limited
R1 R2 R29 R36-R38 = 10k 5% 0603: Resistor, SMD, 10k, 0.1W, 5%, 0603
R3 = 4k7 5% 0603: Resistor, SMD, 4k7, 0.1W, 5%, 0603
R4 R5 = 330R 5% 0603: Resistor, SMD, 330R, 0.1W, 5%, 0603
R28 R35 = 10k 1% 0603: Resistor, SMD, 10k, 0.1W, 1%, 0603
R39 R40 = 2k2 5% 0603: Resistor, SMD, 2k2, 0.1W, 5%, 0603
SW1 = BTN B3U-1000P: Omron B3U-1000P Ultra Miniture Switch; ComponentLink1Description: LCSC; ComponentLink1URL: https://lcsc.com/product-detail/Tactile-Switches_BRIGHT-TSA063G50-250_C294565.html
SW? = SM1020: 4 Pin DIL Switch
U1 = STM32F042C6: ARM® Cortex®-M0 STM32F0 Microcontroller IC 32-Bit 48MHz 32KB (32K x 8) FLASH 48-LQFP (7x7); ComponentLink1Description: Digikey; ComponentLink1URL: https://www.digikey.com.au/product-detail/en/stmicroelectronics/STM32F042C6T6TR/497-19319-1-ND/10063344; ComponentLink2Description: Datasheet; ComponentLink2URL: https://www.st.com/resource/en/datasheet/stm32f042k6.pdf
U2 U11 = LM66100: Diode, SMD, 5.5V, 1.5A, SC-70; Manufacturer: ON Semiconductor / Fairchild; Manufacturer Part Number: 1N914BWS; Average Rectified Current: 150mA; Element Configuration: Single; Forward Voltage: 1V; Max Repetitive Reverse Voltage (Vrrm): 75V; Max Reverse Leakage Current: 5uA; Power Dissipation: 200mW; Recovery Time: 4ns; Max Forward Surge Current (Ifsm): 4A; Parameter 1: *; Weight: 0.0276g; Category: Rectifier Diodes; Contact Plating: Tin,Matte; Forward Current: 150mA; Lead Free: Lead Free; Max Operating Temperature: 150°C; Max Reverse Voltage (DC): 75V; Min Operating Temperature: -55°C; Mount: Surface Mount; Number of Pins: 2; Package Quantity: 1; Packaging: Tape and Reel; Peak Reverse Current: 5uA; Radiation Hardening: No; REACH SVHC: No SVHC; Reverse Recovery Time: 4ns; Height: 1mm; Length: 1.8mm; Reverse Voltage: 75V; Width: 1.35mm
U10 = DSC1001DI1-008.0000T: 8MHz XO (Standard) CMOS Oscillator 1.8 ~ 3.3V Standby (Power Down) 4-SMD, No Lead
Z1 Z2 = LogicAnalyer

## Sheet BMS-S02-V01-CellMonitor.SchDoc: Cell Monitor
size A3; DrawnBy: Sam Haines; DocumentNumber: 5; Revision: 01; SheetNumber: 5; SheetTotal: 10; Version: 01; Project: Battery Managment System 2020; PageSetup: Record=PageOptions|CenterHorizontal=True|CenterVertical=True|PrintScale=0.97|XCorrection=1.00|YCorrection=1.00|PrintKind=0|BorderSize=5000000|LeftOffset=0|BottomOffset=0|Orientation=2|PaperLength=1000|PaperWidth=1000|Scale=100|PaperSource=7|PrintQuality=-4|MediaType=1|DitherType=10|PaperKind=A4|PrintScaleMode=1
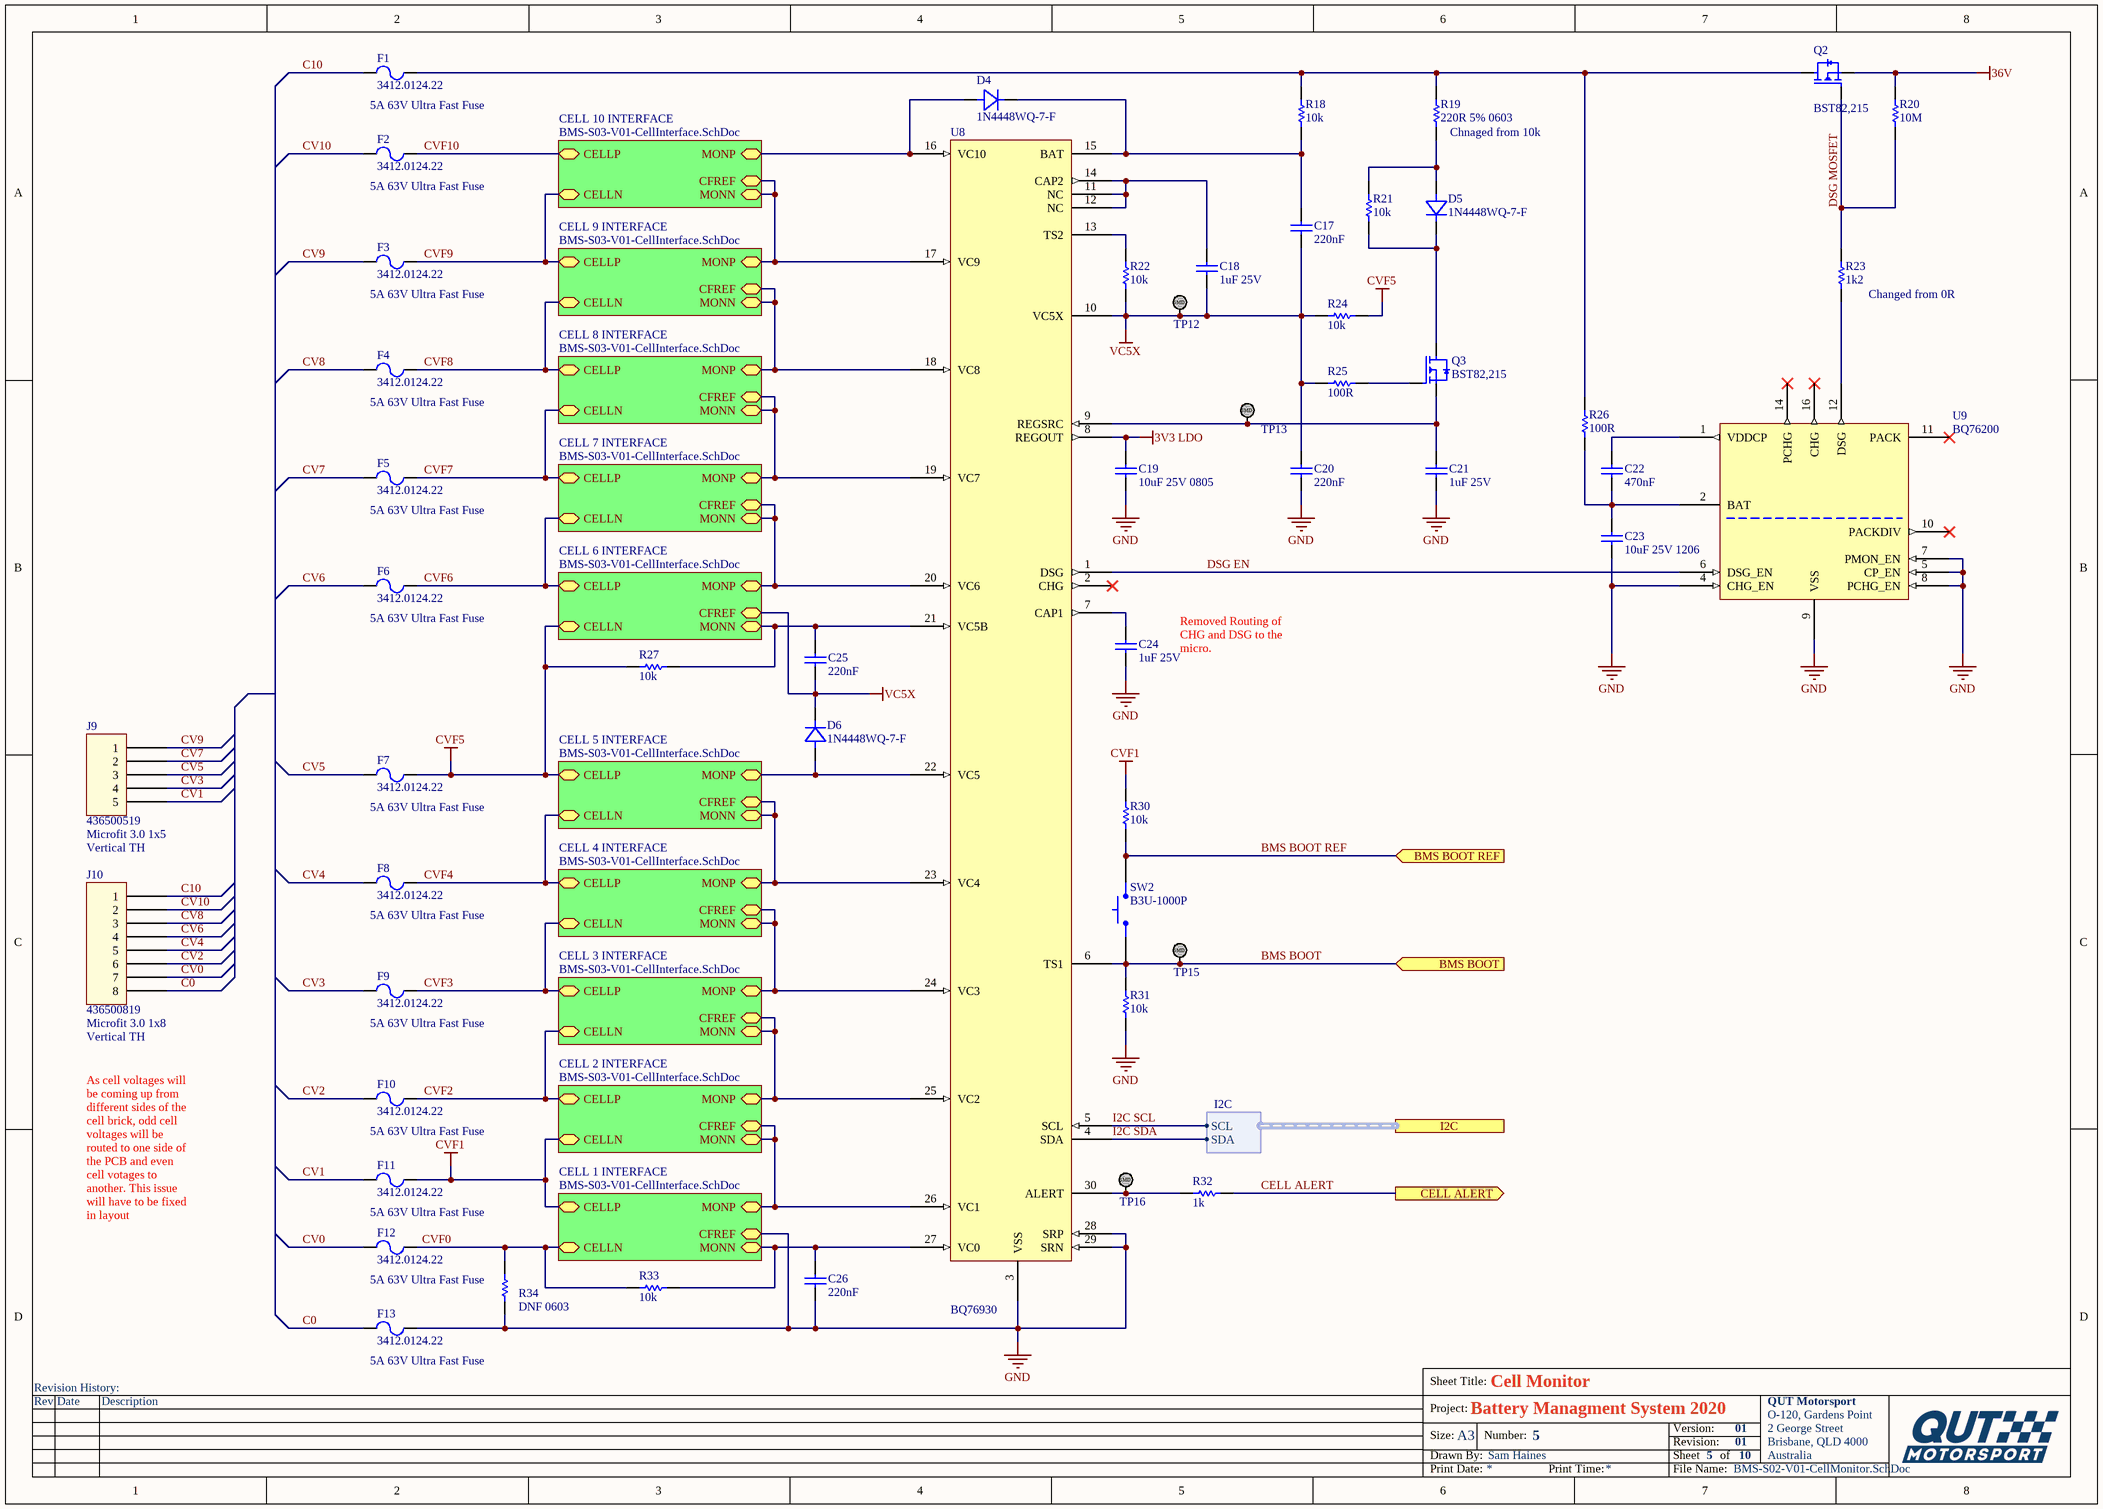
[diagram p4: BMS-S02-V01-CellMonitor.SchDoc]

### Parts
C17  220nF  [Cap_Ceramic_0603]
C18  1uF 25V  [Cap_Ceramic_0603]
C19  10uF 25V 0805  [Cap_Ceramic_0805]
C20  220nF  [Cap_Ceramic_0603]
C21  1uF 25V  [Cap_Ceramic_0603]
C22  470nF  [Cap_Ceramic_0603]
C23  10uF 25V 1206  [Cap_Ceramic_1206]
C24  1uF 25V  [Cap_Ceramic_0603]
C25  220nF  [Cap_Ceramic_0603]
C26  220nF  [Cap_Ceramic_0603]
D4  1N4448WQ-7-F  [SMA]
D5  1N4448WQ-7-F  [SMA]
D6  1N4448WQ-7-F  [SMA]
F1  3412.0124.22  [3412.0124.22]
F2  3412.0124.22  [3412.0124.22]
F3  3412.0124.22  [3412.0124.22]
F4  3412.0124.22  [3412.0124.22]
F5  3412.0124.22  [3412.0124.22]
F6  3412.0124.22  [3412.0124.22]
F7  3412.0124.22  [3412.0124.22]
F8  3412.0124.22  [3412.0124.22]
F9  3412.0124.22  [3412.0124.22]
F10  3412.0124.22  [3412.0124.22]
F11  3412.0124.22  [3412.0124.22]
F12  3412.0124.22  [3412.0124.22]
F13  3412.0124.22  [3412.0124.22]
J9  436500519  [Microfit_1X5_V_TH]
J10  436500819  [Microfit_1X8_V_TH]
Q2  BST82,215  [BST82,215]
Q3  BST82,215  [BST82,215]
R18  10k  [Res_ThinFilm_0603]
R19  220R 5% 0603  [Res_ThinFilm_0603]
R20  10M  [Res_ThinFilm_0603]
R21  10k  [Res_ThinFilm_0603]
R22  10k  [Res_ThinFilm_0603]
R23  1k2  [Res_ThinFilm_0603]
R24  10k  [Res_ThinFilm_0603]
R25  100R  [Res_ThinFilm_0603]
R26  100R  [Res_ThinFilm_0603]
R27  10k  [Res_ThinFilm_0603]
R30  10k  [Res_ThinFilm_0603]
R31  10k  [Res_ThinFilm_0603]
R32  1k  [Res_ThinFilm_0603]
R33  10k  [Res_ThinFilm_0603]
R34  DNF 0603  [Res_ThinFilm_0603]
SW2  B3U-1000P  [BTN B3U-1000P]
TP12  TestPoint_SMD  [TestPointSMD]  (value not drawn)
TP13  TestPoint_SMD  [TestPointSMD]  (value not drawn)
TP15  TestPoint_SMD  [TestPointSMD]  (value not drawn)
TP16  TestPoint_SMD  [TestPointSMD]  (value not drawn)
U8  BQ76930  [bq76930]
U9  BQ76200  [BQ76200]

### Sub-sheets
CELL 1 INTERFACE = BMS-S03-V01-CellInterface.SchDoc: CFREF (bidir), MONP (bidir), MONN (bidir), CELLP (bidir), CELLN (bidir)
CELL 2 INTERFACE = BMS-S03-V01-CellInterface.SchDoc: CFREF (bidir), MONP (bidir), MONN (bidir), CELLP (bidir), CELLN (bidir)
CELL 3 INTERFACE = BMS-S03-V01-CellInterface.SchDoc: CFREF (bidir), MONP (bidir), MONN (bidir), CELLP (bidir), CELLN (bidir)
CELL 4 INTERFACE = BMS-S03-V01-CellInterface.SchDoc: CFREF (bidir), MONP (bidir), MONN (bidir), CELLP (bidir), CELLN (bidir)
CELL 5 INTERFACE = BMS-S03-V01-CellInterface.SchDoc: CFREF (bidir), MONP (bidir), MONN (bidir), CELLP (bidir), CELLN (bidir)
CELL 6 INTERFACE = BMS-S03-V01-CellInterface.SchDoc: CFREF (bidir), MONP (bidir), MONN (bidir), CELLP (bidir), CELLN (bidir)
CELL 7 INTERFACE = BMS-S03-V01-CellInterface.SchDoc: CFREF (bidir), MONP (bidir), MONN (bidir), CELLP (bidir), CELLN (bidir)
CELL 8 INTERFACE = BMS-S03-V01-CellInterface.SchDoc: CFREF (bidir), MONP (bidir), MONN (bidir), CELLP (bidir), CELLN (bidir)
CELL 9 INTERFACE = BMS-S03-V01-CellInterface.SchDoc: CFREF (bidir), MONP (bidir), MONN (bidir), CELLP (bidir), CELLN (bidir)
CELL 10 INTERFACE = BMS-S03-V01-CellInterface.SchDoc: CFREF (bidir), MONP (bidir), MONN (bidir), CELLP (bidir), CELLN (bidir)

### Ports
BMS BOOT (in), BMS BOOT REF (in), CELL ALERT (out), I2C (harness I2C)

### Harnesses
I2C: SDA, SCL

### Nets
3V3 LDO: C19.2 U8.8(REGOUT)
36V: Q2.S(Source) R20.2
CVF1: F11.2 R30.2 ; sheet CELL 1 INTERFACE/CELLP, sheet CELL 2 INTERFACE/CELLN
CVF5: F7.2 R24.2 R27.1 ; sheet CELL 5 INTERFACE/CELLP, sheet CELL 6 INTERFACE/CELLN
GND: C19.1 C20.1 C21.1 C23.1 C24.1 C26.1 F13.2 R31.1 R34.1 U8.3(VSS) U8.28(SRP) U8.29(SRN) U9.4(CHG_EN) U9.5(CP_EN) U9.7(PMON_EN) U9.8(PCHG_EN) U9.9(VSS) ; sheet CELL 1 INTERFACE/CFREF
VC5X: C17.1 C18.1 C20.2 C25.1 D6.K(Cathode) R22.1 R24.1 R25.2 TP12.1 U8.10(VC5X) ; sheet CELL 6 INTERFACE/CFREF
BMS BOOT: R31.2 SW2.1 TP15.1 U8.6(TS1) ; port BMS BOOT
BMS BOOT REF: R30.1 SW2.2 ; port BMS BOOT REF
C0: F13.1 J10.8
C10: F1.1 J10.1
CELL ALERT: R32.2 ; port CELL ALERT
CV0: F12.1 J10.7
CV1: F11.1 J9.5
CV2: F10.1 J10.6
CV3: F9.1 J9.4
CV4: F8.1 J10.5
CV5: F7.1 J9.3
CV6: F6.1 J10.4
CV7: F5.1 J9.2
CV8: F4.1 J10.3
CV9: F3.1 J9.1
CV10: F2.1 J10.2
CVF0: F12.2 R33.1 R34.2 ; sheet CELL 1 INTERFACE/CELLN
CVF2: F10.2 ; sheet CELL 2 INTERFACE/CELLP, sheet CELL 3 INTERFACE/CELLN
CVF3: F9.2 ; sheet CELL 3 INTERFACE/CELLP, sheet CELL 4 INTERFACE/CELLN
CVF4: F8.2 ; sheet CELL 4 INTERFACE/CELLP, sheet CELL 5 INTERFACE/CELLN
CVF6: F6.2 ; sheet CELL 6 INTERFACE/CELLP, sheet CELL 7 INTERFACE/CELLN
CVF7: F5.2 ; sheet CELL 7 INTERFACE/CELLP, sheet CELL 8 INTERFACE/CELLN
CVF8: F4.2 ; sheet CELL 8 INTERFACE/CELLP, sheet CELL 9 INTERFACE/CELLN
CVF9: F3.2 ; sheet CELL 10 INTERFACE/CELLN, sheet CELL 9 INTERFACE/CELLP
CVF10: F2.2 ; sheet CELL 10 INTERFACE/CELLP
DSG EN: U8.1(DSG) U9.6(DSG_EN)
DSG MOSFET: Q2.G(Gate) R20.1 R23.2
I2C SCL: U8.5(SCL) ; port I2C.SCL
I2C SDA: U8.4(SDA) ; port I2C.SDA
NetC16A_1: U8.17(VC9) ; sheet CELL 10 INTERFACE/CFREF, sheet CELL 10 INTERFACE/MONN, sheet CELL 9 INTERFACE/MONP
NetC16A_2: D4.A(Anode) U8.16(VC10) ; sheet CELL 10 INTERFACE/MONP
NetC16B_2: U8.26(VC1) ; sheet CELL 1 INTERFACE/MONP, sheet CELL 2 INTERFACE/CFREF, sheet CELL 2 INTERFACE/MONN
NetC16C_2: U8.25(VC2) ; sheet CELL 2 INTERFACE/MONP, sheet CELL 3 INTERFACE/CFREF, sheet CELL 3 INTERFACE/MONN
NetC16D_2: U8.24(VC3) ; sheet CELL 3 INTERFACE/MONP, sheet CELL 4 INTERFACE/CFREF, sheet CELL 4 INTERFACE/MONN
NetC16E_2: U8.23(VC4) ; sheet CELL 4 INTERFACE/MONP, sheet CELL 5 INTERFACE/CFREF, sheet CELL 5 INTERFACE/MONN
NetC16F_2: D6.A(Anode) U8.22(VC5) ; sheet CELL 5 INTERFACE/MONP
NetC16G_2: U8.20(VC6) ; sheet CELL 6 INTERFACE/MONP, sheet CELL 7 INTERFACE/CFREF, sheet CELL 7 INTERFACE/MONN
NetC16H_2: U8.19(VC7) ; sheet CELL 7 INTERFACE/MONP, sheet CELL 8 INTERFACE/CFREF, sheet CELL 8 INTERFACE/MONN
NetC16I_2: U8.18(VC8) ; sheet CELL 8 INTERFACE/MONP, sheet CELL 9 INTERFACE/CFREF, sheet CELL 9 INTERFACE/MONN
NetC17_2: C17.2 D4.K(Cathode) R18.1 U8.15(BAT)
NetC18_2: C18.2 U8.11(NC) U8.12(NC) U8.14(CAP2)
NetC21_2: C21.2 Q3.S(Source) TP13.1 U8.9(REGSRC)
NetC22_1: C22.1 C23.2 R26.1 U9.2(BAT)
NetC22_2: C22.2 U9.1(VDDCP)
NetC24_2: C24.2 U8.7(CAP1)
NetC25_2: C25.2 R27.2 U8.21(VC5B) ; sheet CELL 6 INTERFACE/MONN
NetC26_2: C26.2 R33.2 U8.27(VC0) ; sheet CELL 1 INTERFACE/MONN
NetD5_A: D5.A(Anode) R19.1 R21.2
NetD5_K: D5.K(Cathode) Q3.D(Drain) R21.1
NetF1_2: F1.2 Q2.D(Drain) R18.2 R19.2 R26.2
NetQ3_G: Q3.G(Gate) R25.1
NetR22_2: R22.2 U8.13(TS2)
NetR23_1: R23.1 U9.12(DSG)
NetR32_1: R32.1 TP16.1 U8.30(ALERT)

Not connected (* = marked no-connect by the designer): U8 2(CHG)*; U9 10(PACKDIV)* 11(PACK)* 14(PCHG)* 16(CHG)*

### Notes on the sheet
- 5A 63V Ultra Fast Fuse
- (near R19) Chnaged from 10k
- (near F2) 5A 63V Ultra Fast Fuse
- (near F3) 5A 63V Ultra Fast Fuse
- (near R23) Changed from 0R
- (near F4) 5A 63V Ultra Fast Fuse
- (near F5) 5A 63V Ultra Fast Fuse
- (near F6) 5A 63V Ultra Fast Fuse
- Removed Routing of CHG and DSG to the micro.
- (near J9) Microfit 3.0 1x5
- Vertical TH
- (near F7) 5A 63V Ultra Fast Fuse
- (near F8) 5A 63V Ultra Fast Fuse
- (near J10) Microfit 3.0 1x8
- (near J10) Vertical TH
- (near F9) 5A 63V Ultra Fast Fuse
- As cell voltages will be coming up from different sides of the cell brick, odd cell voltages will be routed to one side of the PCB and even cell votages to another. This issue will have to be fixed in layout
- (near R34) 5A 63V Ultra Fast Fuse
- (near F13) 5A 63V Ultra Fast Fuse
- Revision History:
- Sheet Title:
- Rev
- Date
- Description
- Project:
- Size:
- Drawn By:
- A3
- Number:
- Revision:
- Sheet
- Version:
- of
- QUT Motorsport
- O-120, Gardens Point
- 2 George Street
- Brisbane, QLD 4000
- Australia
- Print Date:
- Print Time:
- File Name:
- (in symbol TestPoint_SMD) SMD

### Library data of the parts
C17 C20 C25 C26 = 220nF 50V 5% X7R 0603: Capacitor, Ceramic, SMD, 220nF, 50V, 5%, X7R, 0603
C18 C21 C24 = 1uF 25V 5% X7R 0603: Capacitor, Ceramic, SMD, 1uF, 25V, 5%, X7R, 0603
C19 = 10uF 25V 5% X7R 0805_1: Capacitor, Ceramic, SMD, 10uF, 25V, 5%, X7R, 0805
C22 = 470nF 50V 5% X7R 0603: Capacitor, Ceramic, SMD, 470nF, 50V, 5%, X7R, 0603
C23 = 10uF 25V 10% X7R 1206: Capacitor, Ceramic, SMD, 10uF, 25V, 10%, X7R, 1206
D4-D6 = 1N4448WQ-7-F: Diode, SMD, 75V, 5%, 250mA, SOD123; Manufacturer: ON Semiconductor / Fairchild; Manufacturer Part Number: 1N914BWS; Average Rectified Current: 150mA; Element Configuration: Single; Forward Voltage: 1V; Max Reverse Leakage Current: 5uA; Power Dissipation: 200mW; Recovery Time: 4ns; Max Forward Surge Current (Ifsm): 4A; Parameter 1: *; Weight: 0.0276g; Category: Rectifier Diodes; Contact Plating: Tin,Matte; Forward Current: 150mA; Lead Free: Lead Free; Max Operating Temperature: 150°C; Max Repetitive Reverse Voltage (Vrrm): 75V; Max Reverse Voltage (DC): 75V; Min Operating Temperature: -55°C; Mount: Surface Mount; Number of Pins: 2; Package Quantity: 1; Packaging: Tape and Reel; Peak Reverse Current: 5uA; Radiation Hardening: No; REACH SVHC: No SVHC; Reverse Recovery Time: 4ns; Height: 1mm; Length: 1.8mm; Reverse Voltage: 75V; Width: 1.35mm
F1-F13 = 3412.0124.22: FUSE BOARD MOUNT 5A 63VDC 0603
J9 = Microfit_1x5
J10 = Microfit_1x8
Q2 = BST82,215: MOSFET N-CH, 20V, SOT23 / Alternate Part / 2N7002LT1G0SCT-ND /
Q3 = BST82,215: MOSFET N-CH, 20V, SOT23
R18 R21 R22 R24 R27 R30 R31 R33 = 10k 5% 0603: Resistor, SMD, 10k, 0.1W, 5%, 0603
R19 = 470R 5% 0603: Resistor, SMD, 220R, 0.1W, 5%, 0603
R20 = 10M 5% 0603: Resistor, SMD, 10M, 0.1W, 5%, 0603
R23 = 0R 5% 0603: Resistor, SMD, 1k2R, 0.1W, 5%, 0603
R25 R26 = 100R 5%, 0603: Resistor, SMD, 100R, 0.1W, 5%, 0603
R32 = 1k 5% 0603: Resistor, SMD, 1k, 0.1W, 5%, 0603
R34 = DNF 0603: Resistor, SMD, DNF, 0.1W, 0603
SW2 = BTN B3U-1000P: Omron B3U-1000P Ultra Miniture Switch; ComponentLink1Description: LCSC; ComponentLink1URL: https://lcsc.com/product-detail/Tactile-Switches_BRIGHT-TSA063G50-250_C294565.html
U8 = BQ76930: Battery Monitoring/Fuel Gauge Li-Ion/Li-Polymer/LiFePO4 0V to 16V 30-Pin TSSOP T/R; InternalPart: Test1234; Manufacturer: Texas Instruments; Manufacturer Part Number: BQ7693003DBTR; Operating Supply Voltage: 25V; Interface: I2C; Fault Protection: Over Current,Short Circuit,Over/Under Voltage; Supplier 1: Digi-Key; RoHS: Yes; Category: Battery Management; Stock 1: 4521; Pricing 1: 1=4.66000, 10=4.18900, 25=3.96000, 100=3.25600, 250=2.92160, 500=2.81600, 1000=2.34080 (USD); Mount: Surface Mount; Case/Package: TFSOP; Number of Pins: 30; Weight: 0.003439oz; Contact Plating: Gold; Min Operating Temperature: -40°C; Max Operating Temperature: 85°C; Output Voltage: 16V; Packaging: Tape and Reel; Package Quantity: 2000; Lead Free: Lead Free; ComponentLink1URL: http://www.ti.com/lit/gpn/bq76930?src-supplier=Mouser; ComponentLink1Description: http://www.ti.com/lit/gpn/bq76930?src-supplier=Mouser; ComponentLink2URL: http://www.ti.com/lit/ds/symlink/bq76930.pdf?src-supplier=Digi-Key; ComponentLink2Description: http://www.ti.com/lit/ds/symlink/bq76930.pdf?src-supplier=Digi-Key; ComponentLink3URL: http://www.ti.com/lit/pdf/slpt038?src-supplier=Digi-Key; ComponentLink3Description: http://www.ti.com/lit/pdf/slpt038?src-supplier=Digi-Key; ComponentLink4URL: http://www.ti.com/general/docs/lit/getliterature.tsp?genericPartNumber=BQ76920&amp;&amp;fileType=pdf&src-supplier=Avnet+Asia; ComponentLink4Description: http://www.ti.com/general/docs/lit/getliterature.tsp?genericPartNumber=BQ76920&amp;&amp;fileType=pdf&src-supplier=Avnet+Asia; ComponentLink5URL: http://www.ti.com/general/docs/lit/getliterature.tsp?genericPartNumber=BQ76920&&fileType=pdf&src-supplier=Avnet; ComponentLink5Description: http://www.ti.com/general/docs/lit/getliterature.tsp?genericPartNumber=BQ76920&&fileType=pdf&src-supplier=Avnet; Supplier Part Number 1: 296-39961-1-ND
U9 = BQ76200PWR: High-voltage battery pack front-end charge/discharge high-side NFET driver; Manufacturer: Texas Instruments; MPN: BQ76200PWR

## Sheet BMS-S03-V01-CellInterface.SchDoc: Cell Balancing
size A3; DrawnBy: Sam Haines; DocumentNumber: 6; Revision: 01; SheetNumber: 6; SheetTotal: 10; Version: 01; Project: Battery Managment System 2020; PageSetup: Record=PageOptions|CenterHorizontal=True|CenterVertical=True|PrintScale=0.97|XCorrection=1.00|YCorrection=1.00|PrintKind=0|BorderSize=5000000|LeftOffset=0|BottomOffset=0|Orientation=2|PaperLength=1000|PaperWidth=1000|Scale=100|PaperSource=7|PrintQuality=-4|MediaType=1|DitherType=10|PaperKind=A4|PrintScaleMode=1
Used 10 times, as channels Cell Monitor/CELL 10 INTERFACE, Cell Monitor/CELL 1 INTERFACE, Cell Monitor/CELL 2 INTERFACE, Cell Monitor/CELL 3 INTERFACE, Cell Monitor/CELL 4 INTERFACE, Cell Monitor/CELL 5 INTERFACE, Cell Monitor/CELL 6 INTERFACE, Cell Monitor/CELL 7 INTERFACE, Cell Monitor/CELL 8 INTERFACE, Cell Monitor/CELL 9 INTERFACE. Parts and nets are listed once, with the designators drawn on the sheet.
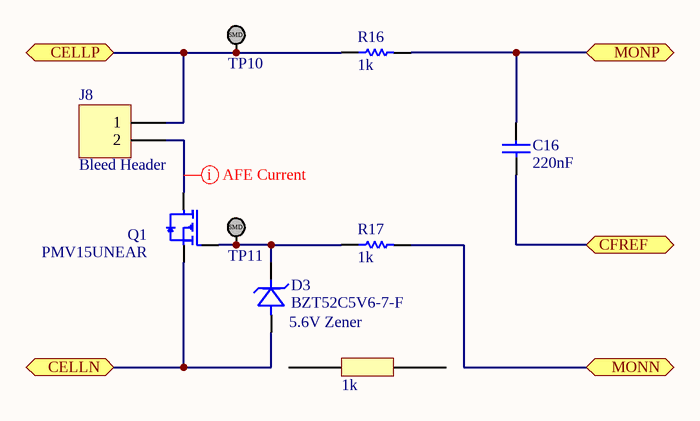
[diagram p5: BMS-S03-V01-CellInterface.SchDoc]

### Parts
C16  220nF  [Cap_Ceramic_0603]
D3  BZT52C5V6-7-F  [SOD123]
J8  Bleed Header  [HDR1X2]
Q1  MOSFET N  [PMV15UNEAR]  (value not drawn)
R16  1k  [Res_ThinFilm_0603]
R17  1k  [Res_ThinFilm_0603]
TP10  TestPoint_SMD  [TestPointSMD]  (value not drawn)
TP11  TestPoint_SMD  [TestPointSMD]  (value not drawn)

### Ports
CELLN (bidir), CELLP (bidir), CFREF (bidir), MONN (bidir), MONP (bidir)

### Nets
CELLN: D3.A(Anode) Q1.S(Source) ; port CELLN
CELLP: J8.1 R16.1 TP10.1 ; port CELLP
CFREF: C16.1 ; port CFREF
MONN: R17.2 ; port MONN
MONP: C16.2 R16.2 ; port MONP
NetD3_K: D3.K(Cathode) Q1.G(Gate) R17.1 TP11.1
NetJ8_2: J8.2 Q1.D(Drain)

### Channels
Cell Monitor/CELL 10 INTERFACE: designators end in A; ports CELLN=CVF9 CELLP=CVF10 CFREF=NetC16A_1 MONN=NetC16A_1 MONP=NetC16A_2
Cell Monitor/CELL 1 INTERFACE: designators end in B; ports CELLN=CVF0 CELLP=CVF1 CFREF=GND MONN=NetC26_2 MONP=NetC16B_2
Cell Monitor/CELL 2 INTERFACE: designators end in C; ports CELLN=CVF1 CELLP=CVF2 CFREF=NetC16B_2 MONN=NetC16B_2 MONP=NetC16C_2
Cell Monitor/CELL 3 INTERFACE: designators end in D; ports CELLN=CVF2 CELLP=CVF3 CFREF=NetC16C_2 MONN=NetC16C_2 MONP=NetC16D_2
Cell Monitor/CELL 4 INTERFACE: designators end in E; ports CELLN=CVF3 CELLP=CVF4 CFREF=NetC16D_2 MONN=NetC16D_2 MONP=NetC16E_2
Cell Monitor/CELL 5 INTERFACE: designators end in F; ports CELLN=CVF4 CELLP=CVF5 CFREF=NetC16E_2 MONN=NetC16E_2 MONP=NetC16F_2
Cell Monitor/CELL 6 INTERFACE: designators end in G; ports CELLN=CVF5 CELLP=CVF6 CFREF=VC5X MONN=NetC25_2 MONP=NetC16G_2
Cell Monitor/CELL 7 INTERFACE: designators end in H; ports CELLN=CVF6 CELLP=CVF7 CFREF=NetC16G_2 MONN=NetC16G_2 MONP=NetC16H_2
Cell Monitor/CELL 8 INTERFACE: designators end in I; ports CELLN=CVF7 CELLP=CVF8 CFREF=NetC16H_2 MONN=NetC16H_2 MONP=NetC16I_2
Cell Monitor/CELL 9 INTERFACE: designators end in J; ports CELLN=CVF8 CELLP=CVF9 CFREF=NetC16I_2 MONN=NetC16I_2 MONP=NetC16A_1

### Layout directives
rule Width Constraint [Pref Width = 20mil    Min Width = 15mil    Max Width = 30mil]: NetJ8A_2

### Notes on the sheet
- (near D3) 5.6V Zener
- 1k
- Revision History:
- Sheet Title:
- Rev
- Date
- Description
- Project:
- Size:
- Drawn By:
- A3
- Number:
- Revision:
- Sheet
- Version:
- of
- QUT Motorsport
- O-120, Gardens Point
- 2 George Street
- Brisbane, QLD 4000
- Australia
- Print Date:
- Print Time:
- File Name:
- (in symbol TestPoint_SMD) SMD

### Library data of the parts
C16 = 220nF 50V 5% X7R 0603: as C17 on sheet BMS-S02-V01-CellMonitor
D3 = BZT52C5V6-7-F: Diode, SMD, Zender, 5.6V, 7%, 500mW, SOD-123; Manufacturer: Generic; MPN: 1.8V 500mW
J8 = Header 2: Header, 2-Pin; LatestRevisionDate: 17-Jul-2002; LatestRevisionNote: Re-released for DXP Platform.; Publisher: Altium Limited
Q1 = PMV15UNEAR: MOSFET N-CH, 20V, SOT23; Manufacturer: Nexperia; Manufacturer Part Number: PMV15UNEAR
R16 R17 = 1k 5% 0603: Resistor, SMD, 1k, 0.1W, 5%, 0603

## Sheet BMS-S07-V01-PSU.SchDoc: Power Supply (20-40V to 3v3 @ 0.1-0.6A)
size A3; DrawnBy: Jonn Dillon; DocumentNumber: 10; Revision: 01; SheetNumber: 10; SheetTotal: 10; Version: 01; Project: Battery Management System 2020; PageSetup: Record=PageOptions|CenterHorizontal=True|CenterVertical=True|PrintScale=0.97|XCorrection=1.00|YCorrection=1.00|PrintKind=0|BorderSize=5000000|LeftOffset=0|BottomOffset=0|Orientation=2|PaperLength=1000|PaperWidth=1000|Scale=100|PaperSource=7|PrintQuality=-4|MediaType=1|DitherType=10|PaperKind=A4|PrintScaleMode=1
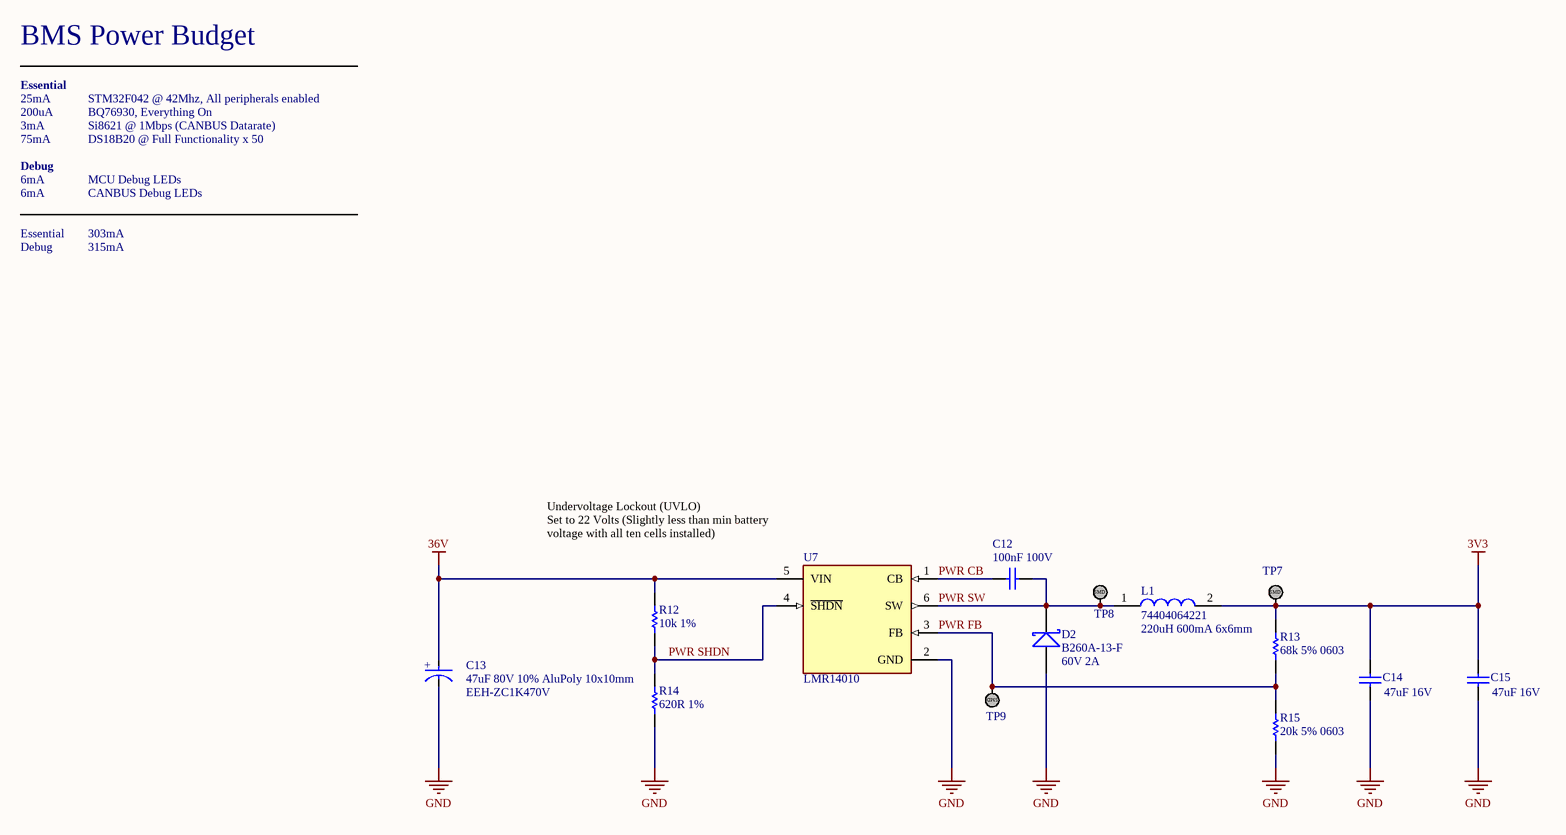
[diagram p6: BMS-S07-V01-PSU.SchDoc]

### Parts
C12  100nF 100V  [Cap_Ceramic_0603]
C13  47uF 80V 10% AluPoly 10x10mm  [CAP_ALU_10x10mm]
C14  47uF 16V  [Cap_Ceramic_1210]
C15  47uF 16V  [Cap_Ceramic_1210]
D2  B260A-13-F  [SMA]
L1  74404064221  [Inductor_6x6mm]
R12  10k 1%  [Res_ThinFilm_0603]
R13  68k 5% 0603  [Res_ThinFilm_0603]
R14  620R 1%  [Res_ThinFilm_0603]
R15  20k 5% 0603  [Res_ThinFilm_0603]
TP7  TestPoint_SMD  [TestPointSMD]  (value not drawn)
TP8  TestPoint_SMD  [TestPointSMD]  (value not drawn)
TP9  TestPoint_SMD  [TestPointSMD]  (value not drawn)
U7  LMR14010  [LMR14010]

### Nets
3V3: C14.2 C15.2 L1.2 R13.2 TP7.1
36V: C13.A R12.2 U7.5(VIN)
GND: C13.K C14.1 C15.1 D2.A R14.1 R15.1 U7.2(GND)
PWR CB: C12.1 U7.1(CB)
PWR FB: R13.1 R15.2 TP9.1 U7.3(FB)
PWR SHDN: R12.1 R14.2 U7.4(~{SHDN})
PWR SW: C12.2 D2.K L1.1 TP8.1 U7.6(SW)

### Notes on the sheet
- BMS Power Budget
- 25mA
- 200uA
- Essential
- STM32F042 @ 42Mhz, All peripherals enabled
- BQ76930, Everything On
- 3mA
- 6mA
- Debug
- 75mA
- Si8621 @ 1Mbps (CANBUS Datarate)
- MCU Debug LEDs
- DS18B20 @ Full Functionality x 50
- CANBUS Debug LEDs
- 303mA
- 315mA
- Undervoltage Lockout (UVLO)
  Set to 22 Volts (Slightly less than min battery voltage with all ten cells installed)
- (near L1) 220uH 600mA 6x6mm
- (near C13) EEH-ZC1K470V
- (near D2) 60V 2A
- Revision History:
- Sheet Title:
- Rev
- Date
- Description
- Project:
- Size:
- Drawn By:
- A3
- Number:
- Revision:
- Sheet
- Version:
- of
- QUT Motorsport
- O-120, Gardens Point
- 2 George Street
- Brisbane, QLD 4000
- Australia
- Print Date:
- Print Time:
- File Name:
- (in symbol 47uF 80V 10% AluPoly 10x10mm) +
- (in symbol TestPoint_SMD) SMD

### Library data of the parts
C12 = 100nF 100V 5% X7R 0603: Capacitor, Ceramic, SMD, 100nF, 100V, 5%, X7R, 0603
C13 = 47uF 80V 10% AluPoly 10x10mm: Capacitor, AluPoly, SMD, 47uF, 80V, 10%, AluPoly, 10x10mm
C14 C15 = 47uF 16V 10% X7R 1210: Capacitor, Ceramic, SMD, 47uF, 16V, 5%, X7R, 1210
D2 = B260A-13-F: Diode, Schottky Barrier Rectifier, 60 V, 2 A, B260A-13-F
L1 = 74404064221: FIXED IND 220UH 660MA 850 MOHM; ComponentLink1Description: Digikey; ComponentLink1URL: https://www.digikey.com.au/product-detail/en/w%C3%BCrth-elektronik/74404064221/732-7261-1-ND/5353241; ComponentLink2Description: LCSC A; ComponentLink2URL: https://lcsc.com/product-detail/Power-Inductors_Sunlord-SWPA6045S221MT_C91047.html; ComponentLink3Description: LCSC B; ComponentLink3URL: https://lcsc.com/product-detail/Power-Inductors_SXN-Shun-Xiang-Nuo-Elec-SMNR6045-221MT_C467145.html
R12 = 10k 1% 0603: Resistor, SMD, 10k, 0.1W, 1%, 0603
R13 = 68k 5% 0603: Resistor, SMD, 68k, 0.1W, 5%, 0603
R14 = 620R 1% 0603: Resistor, SMD, 680R, 0.1W, 5%, 0603
R15 = 20k 5% 0603: Resistor, SMD, 20k, 0.1W, 5%, 0603

## Sheet BMS-S08-V01-TemperatureSensorInterface.SchDoc: Extra Temperature Connection
size A3; DrawnBy: Jonn Dillon; DocumentNumber: 8; Revision: 01; SheetNumber: 8; SheetTotal: 10; Version: 01; Project: Battery Managment System 2020; PageSetup: Record=PageOptions|CenterHorizontal=True|CenterVertical=True|PrintScale=0.97|XCorrection=1.00|YCorrection=1.00|PrintKind=0|BorderSize=5000000|LeftOffset=0|BottomOffset=0|Orientation=2|PaperLength=1000|PaperWidth=1000|Scale=100|PaperSource=7|PrintQuality=-4|MediaType=1|DitherType=10|PaperKind=A4|PrintScaleMode=1
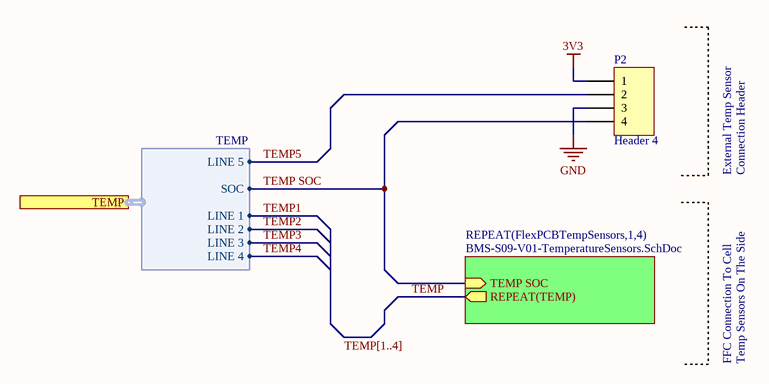
[diagram p7: BMS-S08-V01-TemperatureSensorInterface.SchDoc]

### Parts
P2  Header 4  [HDR1X4]

### Sub-sheets
REPEAT(FlexPCBTempSensors,1,4) = BMS-S09-V01-TemperatureSensors.SchDoc: REPEAT(TEMP) (out), TEMP SOC (in)

### Ports
TEMP (harness TEMP)

### Harnesses
TEMP: LINE 1, LINE 2, LINE 3, LINE 4, LINE 5, SOC

### Nets
3V3: P2.1
GND: P2.3
TEMP: sheet REPEAT(FlexPCBTempSensors,1,4)/REPEAT(TEMP)
TEMP5: P2.2 ; port TEMP.LINE 5
TEMP SOC: P2.4 ; sheet REPEAT(FlexPCBTempSensors,1,4)/TEMP SOC, port TEMP.SOC

### Buses and harness runs
bus TEMP[1..4]

### Notes on the sheet
- External Temp Sensor
- Connection Header
- FFC Connection To Cell
- Temp Sensors On The Side
- Revision History:
- Sheet Title:
- Rev
- Date
- Description
- Project:
- Size:
- Drawn By:
- A3
- Number:
- Revision:
- Sheet
- Version:
- of
- QUT Motorsport
- O-120, Gardens Point
- 2 George Street
- Brisbane, QLD 4000
- Australia
- Print Date:
- Print Time:
- File Name:

### Library data of the parts
P2 = Header 4: Header, 4-Pin; LatestRevisionDate: 17-Jul-2002; LatestRevisionNote: Re-released for DXP Platform.; Publisher: Altium Limited

## Sheet BMS-S09-V01-TemperatureSensors.SchDoc: Temperature Sensors
size A3; DrawnBy: Jonn Dillon; DocumentNumber: 9; SheetNumber: 9; SheetTotal: 10; Version: 01; Project: Battery Managment System 2020; PageSetup: Record=PageOptions|CenterHorizontal=True|CenterVertical=True|PrintScale=0.97|XCorrection=1.00|YCorrection=1.00|PrintKind=0|BorderSize=5000000|LeftOffset=0|BottomOffset=0|Orientation=2|PaperLength=1000|PaperWidth=1000|Scale=100|PaperSource=7|PrintQuality=-4|MediaType=1|DitherType=10|PaperKind=A4|PrintScaleMode=1
Used 4 times, as channels Temperature Sensor Interface/FlexPCBTempSensors1, Temperature Sensor Interface/FlexPCBTempSensors2, Temperature Sensor Interface/FlexPCBTempSensors3, Temperature Sensor Interface/FlexPCBTempSensors4. Parts and nets are listed once, with the designators drawn on the sheet.
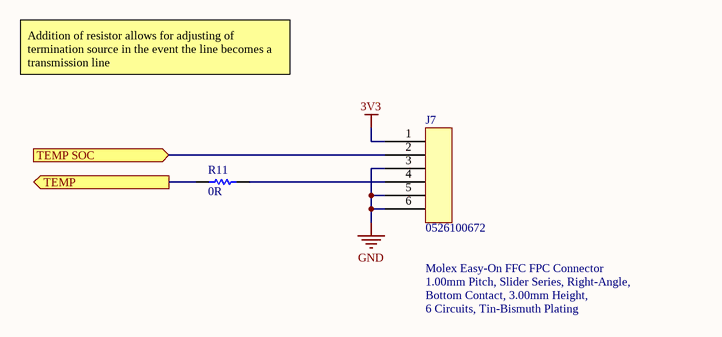
[diagram p8: BMS-S09-V01-TemperatureSensors.SchDoc]

### Parts
J7  0526100672  [526100672]
R11  0R  [Res_ThinFilm_0603]

### Ports
TEMP (out), TEMP SOC (in)

### Nets
3V3: J7.1
GND: J7.3 J7.5 J7.6
TEMP: R11.1 ; port TEMP
TEMP SOC: J7.2 ; port TEMP SOC
NetJ7_4: J7.4 R11.2

### Channels
Temperature Sensor Interface/FlexPCBTempSensors1: designators end in A; ports TEMP SOC=TEMP SOC TEMP=TEMP1
Temperature Sensor Interface/FlexPCBTempSensors2: designators end in B; ports TEMP SOC=TEMP SOC TEMP=TEMP2
Temperature Sensor Interface/FlexPCBTempSensors3: designators end in C; ports TEMP SOC=TEMP SOC TEMP=TEMP3
Temperature Sensor Interface/FlexPCBTempSensors4: designators end in D; ports TEMP SOC=TEMP SOC TEMP=TEMP4

### Notes on the sheet
- Addition of resistor allows for adjusting of termination source in the event the line becomes a transmission line
- Molex Easy-On FFC FPC Connector
- 1.00mm Pitch, Slider Series, Right-Angle,
- Bottom Contact, 3.00mm Height,
- 6 Circuits, Tin-Bismuth Plating
- Revision History:
- Sheet Title:
- Rev
- Date
- Description
- Project:
- Size:
- Drawn By:
- A3
- Number:
- Revision:
- Sheet
- Version:
- of
- QUT Motorsport
- O-120, Gardens Point
- 2 George Street
- Brisbane, QLD 4000
- Australia
- Print Date:
- Print Time:
- File Name:

### Library data of the parts
J7 = 6PinMOLEX
R11 = 0R 5% 0603: Resistor, SMD, 0R, 0.1W, 5%, 0603

## Nets that join several sheets
3V3: BMS-S05-V01-Isolation (R6.2), BMS-S06-V01-IsolatedCAN (C10.2 J4.1 U5.1), BMS-S04-V01-Microcontroller (7 pins), BMS-S07-V01-PSU (5 pins), BMS-S08-V01-TemperatureSensorInterface (P2.1), Temperature Sensor Interface/FlexPCBTempSensors1 (J7A.1), Temperature Sensor Interface/FlexPCBTempSensors2 (J7B.1), Temperature Sensor Interface/FlexPCBTempSensors3 (J7C.1), Temperature Sensor Interface/FlexPCBTempSensors4 (J7D.1)
3V3 LDO: BMS-S04-V01-Microcontroller (C28.2 U2.3 U11.1), BMS-S02-V01-CellMonitor (C19.2 U8.8)
36V: BMS-S02-V01-CellMonitor (Q2.S R20.2), BMS-S07-V01-PSU (C13.A R12.2 U7.5)
CVF1: BMS-S02-V01-CellMonitor (F11.2 R30.2), Cell Monitor/CELL 1 INTERFACE (J8B.1 R16B.1 TP10B.1), Cell Monitor/CELL 2 INTERFACE (D3C.A Q1C.S)
CVF5: BMS-S02-V01-CellMonitor (F7.2 R24.2 R27.1), Cell Monitor/CELL 5 INTERFACE (J8F.1 R16F.1 TP10F.1), Cell Monitor/CELL 6 INTERFACE (D3G.A Q1G.S)
GND: BMS-S06-V01-IsolatedCAN (C10.1 U5.4), BMS-S04-V01-Microcontroller (26 pins), BMS-S02-V01-CellMonitor (17 pins), Cell Monitor/CELL 1 INTERFACE (C16B.1), BMS-S07-V01-PSU (7 pins), BMS-S08-V01-TemperatureSensorInterface (P2.3), Temperature Sensor Interface/FlexPCBTempSensors1 (J7A.3 J7A.5 J7A.6), Temperature Sensor Interface/FlexPCBTempSensors2 (J7B.3 J7B.5 J7B.6), Temperature Sensor Interface/FlexPCBTempSensors3 (J7C.3 J7C.5 J7C.6), Temperature Sensor Interface/FlexPCBTempSensors4 (J7D.3 J7D.5 J7D.6)
ISO 3V3: BMS-S05-V01-Isolation (J2.5 J3.5), BMS-S06-V01-IsolatedCAN (5 pins)
ISO GND: BMS-S05-V01-Isolation (5 pins), BMS-S06-V01-IsolatedCAN (6 pins)
VC5X: BMS-S02-V01-CellMonitor (10 pins), Cell Monitor/CELL 6 INTERFACE (C16G.1)
BMS BOOT: BMS-S05-V01-Isolation (U4.3), BMS-S02-V01-CellMonitor (R31.2 SW2.1 TP15.1 U8.6)
BMS BOOT REF: BMS-S05-V01-Isolation (U4.4), BMS-S02-V01-CellMonitor (R30.1 SW2.2)
CAN H: BMS-S05-V01-Isolation (J2.4 J3.4), BMS-S06-V01-IsolatedCAN (D1.2 J5.1 TP1.1 U6.7)
CAN L: BMS-S05-V01-Isolation (J2.3 J3.3), BMS-S06-V01-IsolatedCAN (D1.1 R10.1 TP4.1 U6.6)
CAN RX: BMS-S06-V01-IsolatedCAN (R9.1 TP6.1 U5.3), BMS-S04-V01-Microcontroller (U1.32 Z2.5)
CAN TX: BMS-S06-V01-IsolatedCAN (R8.1 TP3.1 U5.2), BMS-S04-V01-Microcontroller (U1.33 Z2.7)
CELL ALERT: BMS-S04-V01-Microcontroller (U1.22), BMS-S02-V01-CellMonitor (R32.2)
CVF0: BMS-S02-V01-CellMonitor (F12.2 R33.1 R34.2), Cell Monitor/CELL 1 INTERFACE (D3B.A Q1B.S)
CVF2: BMS-S02-V01-CellMonitor (F10.2), Cell Monitor/CELL 2 INTERFACE (J8C.1 R16C.1 TP10C.1), Cell Monitor/CELL 3 INTERFACE (D3D.A Q1D.S)
CVF3: BMS-S02-V01-CellMonitor (F9.2), Cell Monitor/CELL 3 INTERFACE (J8D.1 R16D.1 TP10D.1), Cell Monitor/CELL 4 INTERFACE (D3E.A Q1E.S)
CVF4: BMS-S02-V01-CellMonitor (F8.2), Cell Monitor/CELL 4 INTERFACE (J8E.1 R16E.1 TP10E.1), Cell Monitor/CELL 5 INTERFACE (D3F.A Q1F.S)
CVF6: BMS-S02-V01-CellMonitor (F6.2), Cell Monitor/CELL 6 INTERFACE (J8G.1 R16G.1 TP10G.1), Cell Monitor/CELL 7 INTERFACE (D3H.A Q1H.S)
CVF7: BMS-S02-V01-CellMonitor (F5.2), Cell Monitor/CELL 7 INTERFACE (J8H.1 R16H.1 TP10H.1), Cell Monitor/CELL 8 INTERFACE (D3I.A Q1I.S)
CVF8: BMS-S02-V01-CellMonitor (F4.2), Cell Monitor/CELL 8 INTERFACE (J8I.1 R16I.1 TP10I.1), Cell Monitor/CELL 9 INTERFACE (D3J.A Q1J.S)
CVF9: BMS-S02-V01-CellMonitor (F3.2), Cell Monitor/CELL 10 INTERFACE (D3A.A Q1A.S), Cell Monitor/CELL 9 INTERFACE (J8J.1 R16J.1 TP10J.1)
CVF10: BMS-S02-V01-CellMonitor (F2.2), Cell Monitor/CELL 10 INTERFACE (J8A.1 R16A.1 TP10A.1)
I2C SCL: BMS-S04-V01-Microcontroller (R40.1 U1.42 Z1.7), BMS-S02-V01-CellMonitor (U8.5)
I2C SDA: BMS-S04-V01-Microcontroller (R39.1 U1.43 Z1.8), BMS-S02-V01-CellMonitor (U8.4)
nALARM: BMS-S05-V01-Isolation (U3.2), BMS-S04-V01-Microcontroller (U1.15)
NetC16A_1: BMS-S02-V01-CellMonitor (U8.17), Cell Monitor/CELL 10 INTERFACE (C16A.1 R17A.2), Cell Monitor/CELL 9 INTERFACE (C16J.2 R16J.2)
NetC16A_2: BMS-S02-V01-CellMonitor (D4.A U8.16), Cell Monitor/CELL 10 INTERFACE (C16A.2 R16A.2)
NetC16B_2: BMS-S02-V01-CellMonitor (U8.26), Cell Monitor/CELL 1 INTERFACE (C16B.2 R16B.2), Cell Monitor/CELL 2 INTERFACE (C16C.1 R17C.2)
NetC16C_2: BMS-S02-V01-CellMonitor (U8.25), Cell Monitor/CELL 2 INTERFACE (C16C.2 R16C.2), Cell Monitor/CELL 3 INTERFACE (C16D.1 R17D.2)
NetC16D_2: BMS-S02-V01-CellMonitor (U8.24), Cell Monitor/CELL 3 INTERFACE (C16D.2 R16D.2), Cell Monitor/CELL 4 INTERFACE (C16E.1 R17E.2)
NetC16E_2: BMS-S02-V01-CellMonitor (U8.23), Cell Monitor/CELL 4 INTERFACE (C16E.2 R16E.2), Cell Monitor/CELL 5 INTERFACE (C16F.1 R17F.2)
NetC16F_2: BMS-S02-V01-CellMonitor (D6.A U8.22), Cell Monitor/CELL 5 INTERFACE (C16F.2 R16F.2)
NetC16G_2: BMS-S02-V01-CellMonitor (U8.20), Cell Monitor/CELL 6 INTERFACE (C16G.2 R16G.2), Cell Monitor/CELL 7 INTERFACE (C16H.1 R17H.2)
NetC16H_2: BMS-S02-V01-CellMonitor (U8.19), Cell Monitor/CELL 7 INTERFACE (C16H.2 R16H.2), Cell Monitor/CELL 8 INTERFACE (C16I.1 R17I.2)
NetC16I_2: BMS-S02-V01-CellMonitor (U8.18), Cell Monitor/CELL 8 INTERFACE (C16I.2 R16I.2), Cell Monitor/CELL 9 INTERFACE (C16J.1 R17J.2)
NetC25_2: BMS-S02-V01-CellMonitor (C25.2 R27.2 U8.21), Cell Monitor/CELL 6 INTERFACE (R17G.2)
NetC26_2: BMS-S02-V01-CellMonitor (C26.2 R33.2 U8.27), Cell Monitor/CELL 1 INTERFACE (R17B.2)
TEMP1: BMS-S04-V01-Microcontroller (U1.38 Z1.3), Temperature Sensor Interface/FlexPCBTempSensors1 (R11A.1)
TEMP2: BMS-S04-V01-Microcontroller (U1.13 Z2.3), Temperature Sensor Interface/FlexPCBTempSensors2 (R11B.1)
TEMP3: BMS-S04-V01-Microcontroller (U1.39 Z1.4), Temperature Sensor Interface/FlexPCBTempSensors3 (R11C.1)
TEMP4: BMS-S04-V01-Microcontroller (U1.40 Z1.5), Temperature Sensor Interface/FlexPCBTempSensors4 (R11D.1)
TEMP5: BMS-S04-V01-Microcontroller (U1.41 Z1.6), BMS-S08-V01-TemperatureSensorInterface (P2.2)
TEMP SOC: BMS-S04-V01-Microcontroller (U1.14 Z2.1), BMS-S08-V01-TemperatureSensorInterface (P2.4), Temperature Sensor Interface/FlexPCBTempSensors1 (J7A.2), Temperature Sensor Interface/FlexPCBTempSensors2 (J7B.2), Temperature Sensor Interface/FlexPCBTempSensors3 (J7C.2), Temperature Sensor Interface/FlexPCBTempSensors4 (J7D.2)